# EAGLE schematic joint_1 (EAGLE 9.6.2)
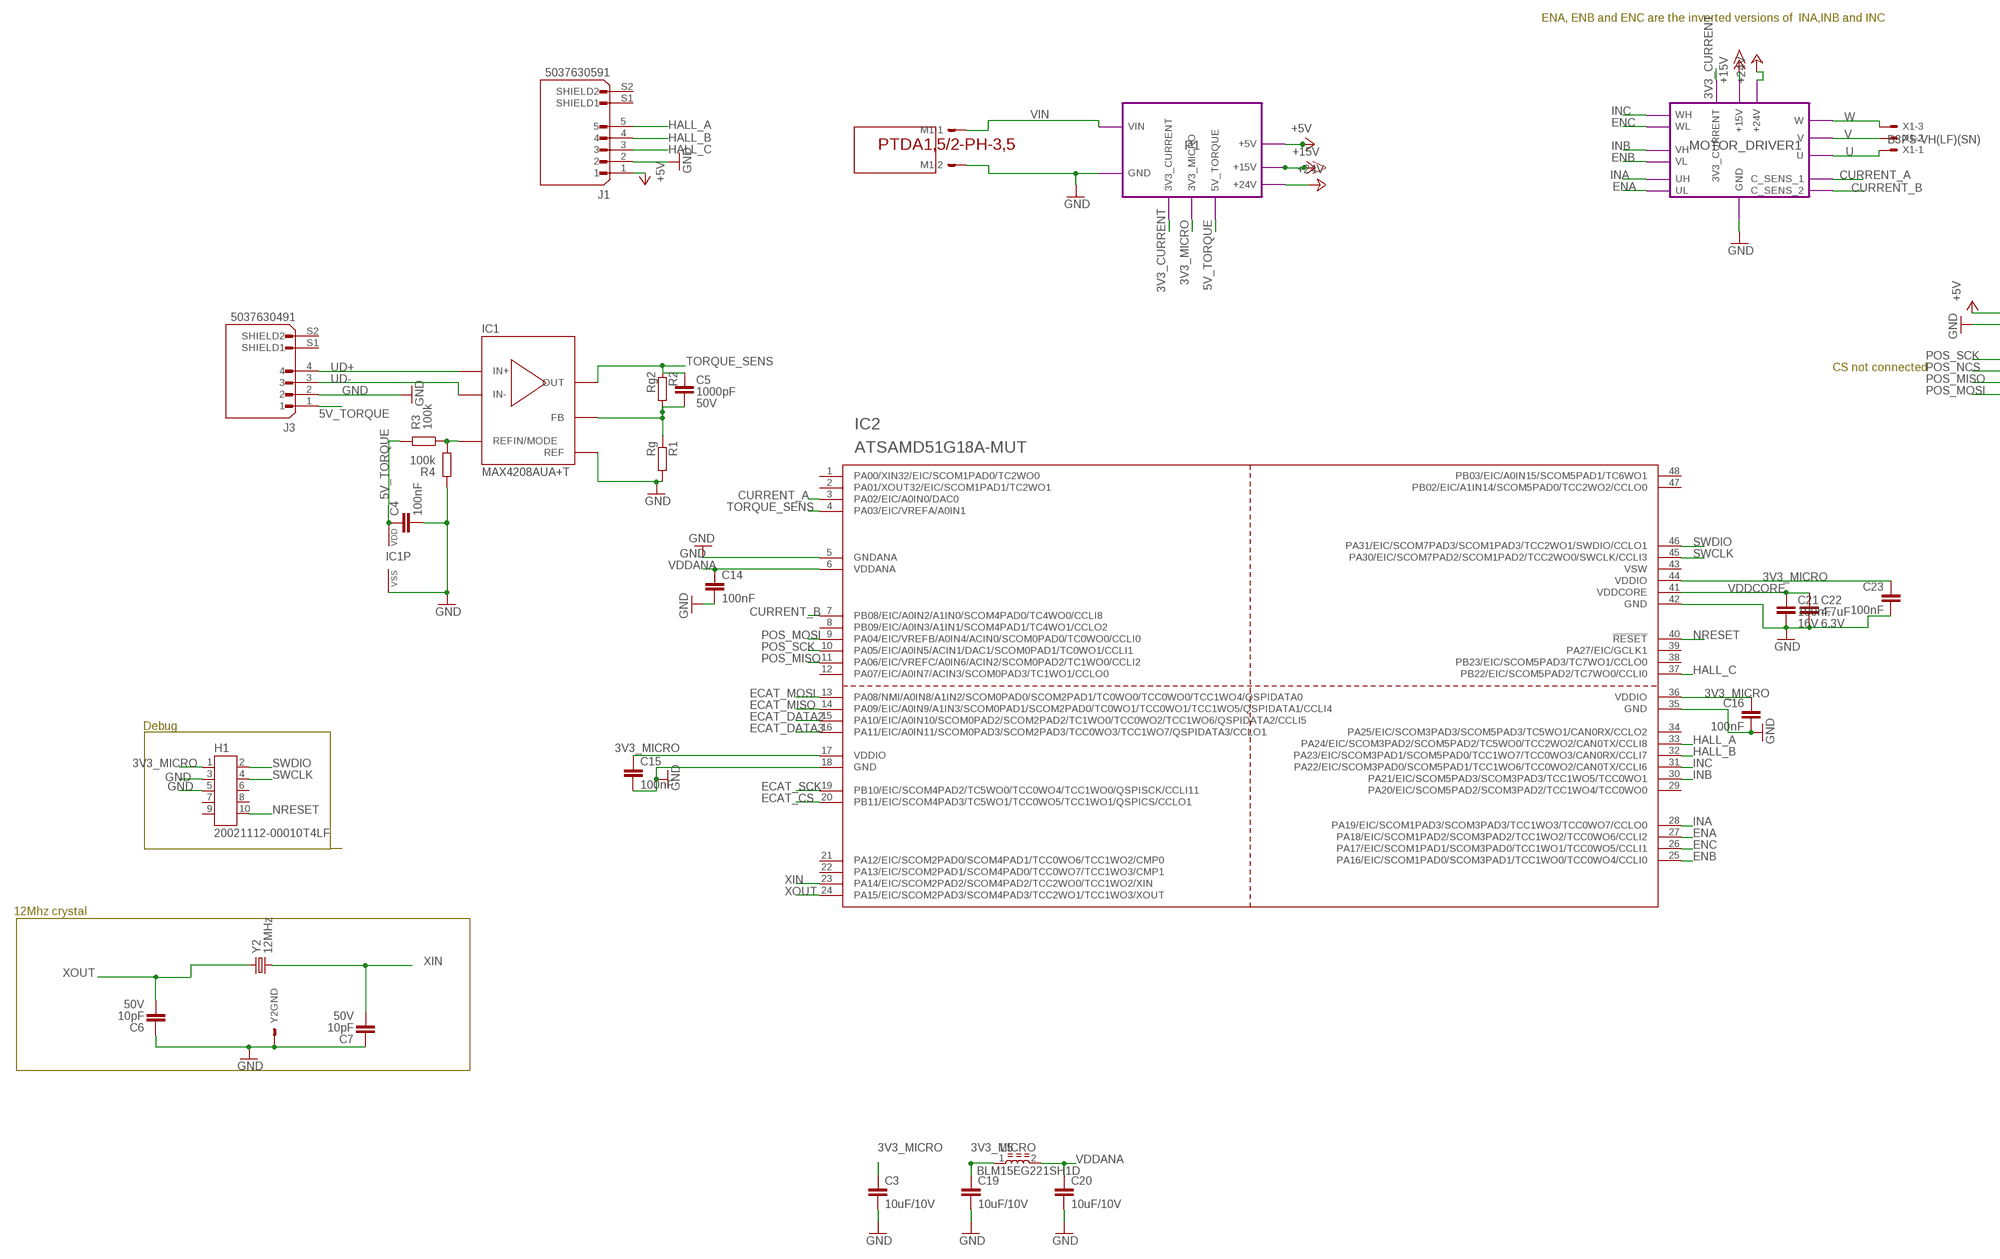
[diagram p0: schematic, sheet 1, part 1 of 2]
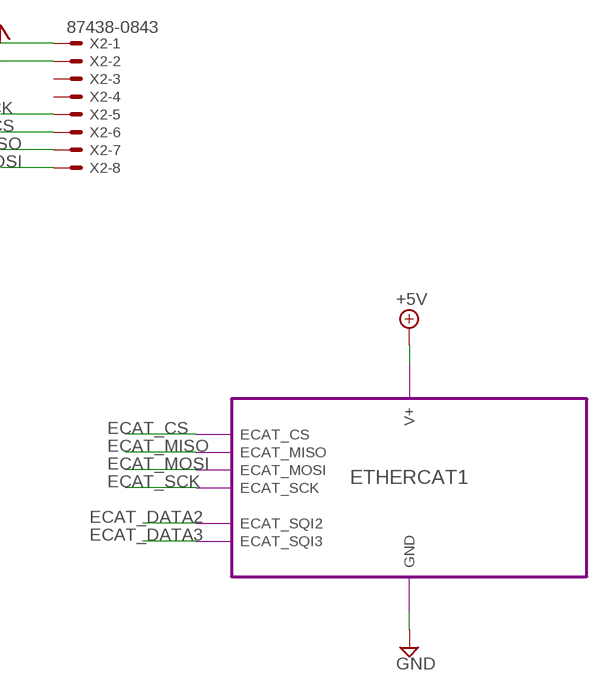
[diagram p1: schematic, sheet 1, part 2 of 2]

## Parts
C3  10uF/10V  C-EUC0603  [C0603]
C4  100nF  C-EUC0402  [C0402]
C5  GCM1555C1H102FA16  [C0402]
C6  GCM1555C1H100JA16  [C0402]
C7  GCM1555C1H100JA16  [C0402]
C14  100nF  C-EUC0402  [C0402]
C15  100nF  C-EUC0402  [C0402]
C16  100nF  C-EUC0402  [C0402]
C19  10uF/10V  C-EUC0603  [C0603]
C20  10uF/10V  C-EUC0603  [C0603]
C21  GCM155R71C104JA55  [C0402]
C22  GRM155C80J475MEAAD  [C0402]
C23  100nF  C-EUC0402  [C0402]
H1  20021112-00010T4LF  [20021112-00010]
IC1  MAX4208AUA+T  [USOP8]
IC2  ATSAMD51G18A-MUT  [QFN48]
J1  5037630591  [MOLEX_5037630591]
J3  5037630491  [MOLEX_5037630491]
L5  BLM15EG221SH1D  [BEAD0402]
M1  PST1,3/2-3,5  [1945096]
R1  Rg  R-EU_R0402  [R0402]
R2  Rg2  R-EU_R0402  [R0402]
R3  RT0402FRE07100KL  [R0402]
R4  RT0402FRE07100KL  [R0402]
U$1  PTDA1,5/2-PH-3,5  [1725107]
X1  B3PS-VH(LF)(SN)  [B3PS-VH(LF)(SN)]
X2  87438-0843  [87438-08]
Y2  ECS-120-10-36B-CKY-TR  [ECX-2236]

## Module instances
MOTOR_DRIVER1 = MOTOR_DRIVER
P1 = POWER
ETHERCAT1 = ETHERCAT

## Nets
3V3_CURRENT: port P1.3V3_CURRENT MOTOR_DRIVER1.3V3_CURRENT
3V3_MICRO: C3.1 C15.1 C16.1 C19.1 C23.1 H1.1 IC2.17(VDDIO) IC2.36(VDDIO) IC2.44(VDDIO) L5.1 ; port P1.3V3_MICRO
5V_TORQUE: C4.1 IC1.8(VDD) J3.1 R3.2 ; port P1.5V_TORQUE
+5V: J1.1 X2.1 ; port P1.+5V ETHERCAT1.V+
+15V: port P1.+15V MOTOR_DRIVER1.+15V
+24V: port P1.+24V MOTOR_DRIVER1.+24V
CURRENT_A: IC2.3(PA02/EIC/A0IN0/DAC0) ; port MOTOR_DRIVER1.C_SENS_1
CURRENT_B: IC2.7(PB08/EIC/A0IN2/A1IN0/SCOM4PAD0/TC4WO0/CCLI8) ; port MOTOR_DRIVER1.C_SENS_2
ECAT_CS: IC2.20(PB11/EIC/SCOM4PAD3/TC5WO1/TCC0WO5/TCC1WO1/QSPICS/CCLO1) ; port ETHERCAT1.ECAT_CS
ECAT_DATA2: IC2.15(PA10/EIC/A0IN10/SCOM0PAD2/SCOM2PAD2/TC1WO0/TCC0WO2/TCC1WO6/QSPIDATA2/CCLI5) ; port ETHERCAT1.ECAT_SQI2
ECAT_DATA3: IC2.16(PA11/EIC/A0IN11/SCOM0PAD3/SCOM2PAD3/TCC0WO3/TCC1WO7/QSPIDATA3/CCLO1) ; port ETHERCAT1.ECAT_SQI3
ECAT_MISO: IC2.14(PA09/EIC/A0IN9/A1IN3/SCOM0PAD1/SCOM2PAD0/TC0WO1/TCC0WO1/TCC1WO5/QSPIDATA1/CCLI4) ; port ETHERCAT1.ECAT_MISO
ECAT_MOSI: IC2.13(PA08/NMI/A0IN8/A1IN2/SCOM0PAD0/SCOM2PAD1/TC0WO0/TCC0WO0/TCC1WO4/QSPIDATA0) ; port ETHERCAT1.ECAT_MOSI
ECAT_SCK: IC2.19(PB10/EIC/SCOM4PAD2/TC5WO0/TCC0WO4/TCC1WO0/QSPISCK/CCLI11) ; port ETHERCAT1.ECAT_SCK
ENA: IC2.27(PA18/EIC/SCOM1PAD2/SCOM3PAD2/TCC1WO2/TCC0WO6/CCLI2) ; port MOTOR_DRIVER1.UL
ENB: IC2.25(PA16/EIC/SCOM1PAD0/SCOM3PAD1/TCC1WO0/TCC0WO4/CCLI0) ; port MOTOR_DRIVER1.VL
ENC: IC2.26(PA17/EIC/SCOM1PAD1/SCOM3PAD0/TCC1WO1/TCC0WO5/CCLI1) ; port MOTOR_DRIVER1.WL
GND: C3.2 C4.2 C6.1 C7.1 C14.2 C15.2 C16.2 C19.2 C20.2 C21.2 C22.2 C23.2 H1.3 H1.5 IC1.4(VSS) IC1.5(REF) IC2.5(GNDANA) IC2.18(GND) IC2.35(GND) IC2.42(GND) J1.2 J3.2 M1.2 R1.2 R4.2 X2.2 Y2.2(S) Y2.4(S) ; port P1.GND MOTOR_DRIVER1.GND ETHERCAT1.GND
HALL_A: IC2.33(PA24/EIC/SCOM3PAD2/SCOM5PAD2/TC5WO0/TCC2WO2/CAN0TX/CCLI8) J1.5
HALL_B: IC2.32(PA23/EIC/SCOM3PAD1/SCOM5PAD0/TCC1WO7/TCC0WO3/CAN0RX/CCLI7) J1.4
HALL_C: IC2.37(PB22/EIC/SCOM5PAD2/TC7WO0/CCLI0) J1.3
INA: IC2.28(PA19/EIC/SCOM1PAD3/SCOM3PAD3/TCC1WO3/TCC0WO7/CCLO0) ; port MOTOR_DRIVER1.UH
INB: IC2.30(PA21/EIC/SCOM5PAD3/SCOM3PAD3/TCC1WO5/TCC0WO1) ; port MOTOR_DRIVER1.VH
INC: IC2.31(PA22/EIC/SCOM3PAD0/SCOM5PAD1/TCC1WO6/TCC0WO2/CAN0TX/CCLI6) ; port MOTOR_DRIVER1.WH
N$1: C5.2 IC1.6(FB) R1.1 R2.2
N$2: IC1.1(REFIN/MODE) R3.1 R4.1
NRESET: H1.10 IC2.40(!RESET)
POS_MISO: IC2.11(PA06/EIC/VREFC/A0IN6/ACIN2/SCOM0PAD2/TC1WO0/CCLI2) X2.7
POS_MOSI: IC2.9(PA04/EIC/VREFB/A0IN4/ACIN0/SCOM0PAD0/TC0WO0/CCLI0) X2.8
POS_NCS: X2.6
POS_SCK: IC2.10(PA05/EIC/A0IN5/ACIN1/DAC1/SCOM0PAD1/TC0WO1/CCLI1) X2.5
SWCLK: H1.4 IC2.45(PA30/EIC/SCOM7PAD2/SCOM1PAD2/TCC2WO0/SWCLK/CCLI3)
SWDIO: H1.2 IC2.46(PA31/EIC/SCOM7PAD3/SCOM1PAD3/TCC2WO1/SWDIO/CCLO1)
TORQUE_SENS: C5.1 IC1.7(OUT) IC2.4(PA03/EIC/VREFA/A0IN1) R2.1
U: X1.3 ; port MOTOR_DRIVER1.U
UD+: IC1.3(IN+) J3.4
UD-: IC1.2(IN-) J3.3
V: X1.2 ; port MOTOR_DRIVER1.V
VDDANA: C14.1 C20.1 IC2.6(VDDANA) L5.2
VDDCORE: C21.1 C22.1 IC2.41(VDDCORE)
VIN: M1.1 ; port P1.VIN
W: X1.1 ; port MOTOR_DRIVER1.W
XIN: C7.2 IC2.23(PA14/EIC/SCOM2PAD2/SCOM4PAD2/TCC2WO0/TCC1WO2/XIN) Y2.1
XOUT: C6.2 IC2.24(PA15/EIC/SCOM2PAD3/SCOM4PAD3/TCC2WO1/TCC1WO3/XOUT) Y2.3
Unconnected: H1.6 H1.7 H1.8 H1.9 IC2.1(PA00/XIN32/EIC/SCOM1PAD0/TC2WO0) IC2.2(PA01/XOUT32/EIC/SCOM1PAD1/TC2WO1) IC2.8(PB09/EIC/A0IN3/A1IN1/SCOM4PAD1/TC4WO1/CCLO2) IC2.12(PA07/EIC/A0IN7/ACIN3/SCOM0PAD3/TC1WO1/CCLO0) IC2.21(PA12/EIC/SCOM2PAD0/SCOM4PAD1/TCC0WO6/TCC1WO2/CMP0) IC2.22(PA13/EIC/SCOM2PAD1/SCOM4PAD0/TCC0WO7/TCC1WO3/CMP1) IC2.29(PA20/EIC/SCOM5PAD2/SCOM3PAD2/TCC1WO4/TCC0WO0) IC2.34(PA25/EIC/SCOM3PAD3/SCOM5PAD3/TC5WO1/CAN0RX/CCLO2) IC2.38(PB23/EIC/SCOM5PAD3/TC7WO1/CCLO0) IC2.39(PA27/EIC/GCLK1) IC2.43(VSW) IC2.47(PB02/EIC/A1IN14/SCOM5PAD0/TCC2WO2/CCLO0) IC2.48(PB03/EIC/A0IN15/SCOM5PAD1/TC6WO1) J1.S1(SHIELD1) J1.S2(SHIELD2) J3.S1(SHIELD1) J3.S2(SHIELD2) X2.3 X2.4

## Notes on the sheet
- ENA, ENB and ENC are the inverted versions of  INA,INB and INC
- CS not connected
- Debug
- 12Mhz crystal

## Library data of the parts
C3 C4 C14-C16 C19 C20 C23 = rcl:C-EU: CAPACITOR, European symbol; SPICEPREFIX: C
C5 = msrm:GCM?5C*: Multilayer Ceramic Capacitors; CAPACITANCE: 1000pF; DIGIKEY: 490-16461-1-ND; TOLERANCE: ±1%; VOLTAGE: 50V
C6 C7 = msrm:GCM?5C*: Multilayer Ceramic Capacitors; CAPACITANCE: 10pF; DIGIKEY: 490-10668-1-ND; TOLERANCE: ±5%; VOLTAGE: 50V
C21 = msrm:GCM?R7*: Multilayer Ceramic Capacitors; CAPACITANCE: 100nF; DIGIKEY: 490-16433-1-ND; TOLERANCE: ±5%; VOLTAGE: 16V
C22 = msrm:GRM?C8*: CAP CER 10UF 6.3V X6S 0402 package: C0402 : 10µF ___ Source: Digikey <https://www.digikey.de/products/en?keywords=490-13233-1-ND> ; Datasheet <https://search.murata.co.jp/Ceramy/image/img/A01X/G101/ENG/GRM155C80J106ME11-01.pdf> 2.2µF ___ Source: Digikey <https://www.digikey.de/products/en?keywords=490-10012-1-ND> ; Datasheet <https://search.murata.co.jp/Ceramy/image/img/A01X/G101/ENG/GRM155C80J225KE95-01.pdf> 4.7µF ___ Source: Digikey <https://www.digikey.de/products/en?keywords=490-14458-1-ND> ; Datasheet <https://search.murata.co.jp/Ceramy/image/img/A01X/G101/ENG/GRM155C80J475MEAA-01.pdf>; CAPACITANCE: 4.7uF; DIGIKEY: 490-14458-1-ND; TOLERANCE: ±20%; VOLTAGE: 6.3V
H1 = msrm:20021?10*LF: Connector Header Surface Mount 10 position 0.050" (1.27mm) Variant: 111-000 609-5923-ND ___ Source: Digikey <https://www.digikey.de/products/de?keywords=609-5923-ND> ; Datasheet <https://cdn.amphenol-icc.com/media/wysiwyg/files/drawing/20021111.pdf> 609-3712-ND ___ Source: Digikey <https://www.digikey.de/products/de?keywords=609-3712-ND> ; Datasheet <https://media.digikey.com/pdf/Data%20Sheets/FCI%20PDFs/Minitek%20127_Catalog.pdf> Variant: 112-000 609-5926-ND ___ Source: Digikey <https://www.digikey.de/products/de?keywords=609-5926-ND> ; Datasheet <https://cdn.amphenol-icc.com/media/wysiwyg/files/drawing/20021112.pdf> Variant: 121-000 609-3695-1-ND ___ Source: Digikey <https://www.digikey.de/products/de?keywords=609-3695-1-ND> ; Datasheet <https://cdn.amphenol-icc.com/media/wysiwyg/files/drawing/20021121.pdf> 609-6529-ND ___ Source: Digikey <https://www.digikey.de/products/de?keywords=609-6529-ND> ; Datasheet <https://cdn.amphenol-icc.com/media/wysiwyg/files/drawing/20021121.pdf> 609-3729-ND ___ Source: Digikey <https://www.digikey.de/products/de?keywords=609-3729-ND> ; Datasheet <https://cdn.amphenol-icc.com/media/wysiwyg/files/drawing/20021121.pdf> Variant: 311-000 609-3754-ND ___ Source: Digikey <https://www.digikey.de/products/de?keywords=609-3754-ND> ; Datasheet <https://cdn.amphenol-icc.com/media/wysiwyg/files/drawing/20021311.pdf>; DIGIKEY: 609-5926-ND; PINS: 10
IC1 = msrm:MAX42*: Instrument Amp Single R-R O/P 2.75/5.5V package: USOP8 : MAX4289 ___ Source: Digikey <https://www.digikey.de/product-detail/en/maxim-integrated/MAX4208AUA-T/MAX4208AUA-TCT-ND/9760057> ; Datasheet <http://datasheets.maximintegrated.com/en/ds/MAX4208-MAX4209.pdf> MAX4209 ___ Source: Digikey <https://www.digikey.de/product-detail/en/maxim-integrated/MAX4209HAUA/MAX4209HAUA-ND/1780104> ; Datasheet <http://datasheets.maximintegrated.com/en/ds/MAX4208-MAX4209.pdf>; DESCRIPTION: Instrument Amp Single R-R O/P 2.75/5.5V; DIGIKEY: MAX4208AUA+-ND; HEIGHT: 1.1mm; INPUT_RESISTANCE: 2G; MANUFACTURER_NAME: Maxim Integrated; MANUFACTURER_PART_NUMBER: MAX4208AUA+; MOUSER_PART_NUMBER: 700-MAX4208AUA; MOUSER_PRICE-STOCK: https://www.mouser.com/Search/Refine.aspx?Keyword=700-MAX4208AUA; RS_PART_NUMBER: 7328406P; RS_PRICE-STOCK: http://uk.rs-online.com/web/p/products/7328406P; SPICEPREFIX: X; SUPPLY_CURRENT: Buffer OFF: 0.75 - 1.3 mA Buffer ON: 1.4 - 2.3 mA; SUPPLY_VOLTAGE: Single: 2.85 - 5.5 Dual: ±1.425 - ±2.75; VOLTAGE_GAIN: 1 - (1 + R2/R1)
IC2 = msrm:ATSAMD51G: Atmel C21 32bit ARM Cortex-M0 microcontroller. Pins 64 GPIO 52 TC 5 TCC 3 DMA 12 USB No CAN 2 CCL 4 SERCOM 6 I2S 0 DIVAS Yes ADCch 20 ADC 2 ADCSDch 3 AC 4 DAC 1 TSENS 1 RTC 1 EIC 16 PTC 32 FREQM Yes MAX_F 48MHz EVENTS 12 WDT Yes SWDI Yes package: QFN48 : D51G18A-MUTCT ___ Source: Digikey <https://www.digikey.de/products/de?keywords=ATSAMD51G18A-MUTCT-ND> ; Datasheet <http://www.microchip.com/mymicrochip/filehandler.aspx?ddocname=en599585> D51G19A-MU ______ Source: Digikey <https://www.digikey.de/products/de?keywords=ATSAMD51G19A-MU-ND> ; Datasheet <http://www.microchip.com/mymicrochip/filehandler.aspx?ddocname=en599585>; DIGIKEY: ATSAMD51G18A-MUTCT-ND; FLASH: 256KB; SRAM: 128KB
J1 = 5037630591:5037630591: Check availability <https://pricing.snapeda.com/parts/503763-0591/Molex/view-part?ref=eda>; AVAILABILITY: In Stock; DESCRIPTION: Connector Header Surface Mount, Right Angle 5 position 0.039 (1.00mm); MF: Molex; MP: 503763-0591; PACKAGE: None; PRICE: None; PURCHASE-URL: https://pricing.snapeda.com/search/part/503763-0591/?ref=eda
J3 = 5037630491:5037630491: Check availability <https://pricing.snapeda.com/parts/5037630491/Molex/view-part?ref=eda>; AVAILABILITY: In Stock; DESCRIPTION: Connector Header Surface Mount, Right Angle 4 position 0.039 (1.00mm); MF: Molex; MP: 5037630491; PACKAGE: None; PRICE: None; PURCHASE-URL: https://pricing.snapeda.com/search/part/5037630491/?ref=eda
L5 = msrm:BLM?EG*1D: Murata's SMD Ferrite Bead BLM18EG Series Source: Part Numbering <https://www.murata.com/en-us/products/productdata/8796733767710/S0580E.pdf>; DC_RES: 280mOhm; DIGIKEY: 490-17345-1-ND; IMPEDANCE-FREQUENCY: 220 Ohms @ 100MHz
M1 = msrm:PST*/2-?: 2 Position Terminal Block Header, Male Pins, Unshrouded 0.138" (3.50mm) Vertical Through Hole 277-1749-ND ___ Source: Digikey <https://www.digikey.de/products/en?keywords=277-1749-ND> ; Datasheet <https://media.digikey.com/pdf/Data%20Sheets/Phoenix%20Contact%20PDFs/Combicon%20Compact%20Series.pdf>; DIGIKEY: 277-1749-ND; PITCH: 3,5
R1 R2 = rcl:R-EU_: RESISTOR, European symbol; SPICEPREFIX: R
R3 R4 = msrm:RT?FRE07*L: SMD RESISTOR; DIGIKEY: YAG2307CT-ND; RVALUE: 100k; SPICEPREFIX: R
U$1 = msrm:PTDA*/2-PH: 2 Position Terminal Block Plug for Unshrouded Header 0.138" (3.50mm) 45° Free Hanging (In-Line) 277-17182-ND ___ Source: Digikey <https://www.digikey.de/products/en?keywords=277-17182-ND> ; Datasheet <https://media.digikey.com/PDF/Data%20Sheets/Phoenix%20Contact%20PDFs/1725107.pdf>; DIGIKEY: 277-17182-ND
X1 = msrm:B3PS-VH(LF)(SN): Connector Header Through Hole, Right Angle 3 position 0.156" (3.96mm) 455-1649 ___ Source: Digikey <https://www.digikey.de/product-detail/en/jst-sales-america-inc/B3PS-VH-LF-SN/455-1649-ND/926556> ; Datasheet <http://www.jst-mfg.com/product/pdf/eng/eVH.pdf>; DIGIKEY: 455-1649-ND
X2 = msrm:8743?-08*3: Wire-to-Board 1.50mm (.059") Pitch Header - SMT, Shrouded Source: http://www.molex.com/product/micro/87437.html; DIGIKEY: WM7652CT-ND
Y2 = msrm:ECS-*?-TR: SMD CRYSTAL Various frequencies, with GND pins Part Numbering <http://www.ecsxtal.com/store/pdf/partnumber4.pdf> package: ECS-33B : XC2845 ___ Source: Digikey <https://www.digikey.de/products/en?keywords=%20XC2845CT-ND> ; Datasheet <https://ecsxtal.com/store/pdf/ECS-33B.pdf> XC2439 ___ Source: Digikey <https://www.digikey.de/products/en?keywords=XC2439CT-ND> ; Datasheet <https://ecsxtal.com/store/pdf/ECS-33B.pdf> XC2458 ___ Source: Digikey <https://www.digikey.de/products/en?keywords=XC2458CT-ND> ; Datasheet <https://ecsxtal.com/store/pdf/ECS-33B.pdf> XC2479 ___ Source: Digikey <https://www.digikey.de/products/en?keywords=XC2479CT-ND> ; Datasheet <https://ecsxtal.com/store/pdf/ECS-33B.pdf> XC2547 ___ Source: Digikey <https://www.digikey.de/products/en?keywords=XC2547CT-ND> ; Datasheet <https://ecsxtal.com/store/pdf/ECS-33B.pdf> package: ECX2236 : XC3046 ___ Source: Digikey <https://www.digikey.de/products/en?keywords=XC3046CT-ND> ; Datasheet <https://ecsxtal.com/store/pdf/ECX-2236B.pdf> XC3048 ___ Source: Digikey <https://www.digikey.de/products/en?keywords=XC3048CT-ND> ; Datasheet <https://ecsxtal.com/store/pdf/ECX-2236B.pdf> XC3051 ___ Source: Digikey <https://www.digikey.de/products/en?keywords=XC3051CT-ND> ; Datasheet <https://ecsxtal.com/store/pdf/ECX-2236B.pdf> XC3093 ___ Source: Digikey <https://www.digikey.de/products/en?keywords=XC3093CT-ND> ; Datasheet <https://ecsxtal.com/store/pdf/ECX-2236B.pdf> XC3053 ___ Source: Digikey <https://www.digikey.de/products/en?keywords=XC3053CT-ND> ; Datasheet <https://ecsxtal.com/store/pdf/ECX-2236B.pdf> XC3052 ___ Source: Digikey <https://www.digikey.de/products/en?keywords=XC3052CT-ND> ; Datasheet <https://ecsxtal.com/store/pdf/ECX-2236B.pdf> XC3054 ___ Source: Digikey <https://www.digikey.de/products/en?keywords=XC3054CT-ND> ; Datasheet <https://ecsxtal.com/store/pdf/ECX-2236B.pdf> XC3057 ___ Source: Digikey <https://www.digikey.de/products/en?keywords=XC3057CT-ND> ; Datasheet <https://ecsxtal.com/store/pdf/ECX-2236B.pdf> XC3058 ___ Source: Digikey <https://www.digikey.de/products/en?keywords=XC3058CT-ND> ; Datasheet <https://ecsxtal.com/store/pdf/ECX-2236B.pdf> XC3060 ___ Source: Digikey <https://www.digikey.de/products/en?keywords=XC3060CT-ND> ; Datasheet <https://ecsxtal.com/store/pdf/ECX-2236B.pdf> XC3059 ___ Source: Digikey <https://www.digikey.de/products/en?keywords=XC3059CT-ND> ; Datasheet <https://ecsxtal.com/store/pdf/ECX-2236B.pdf>; DIGIKEY: XC3046CT-ND; ESR: 130 Ohm; F: 12MHz; F_TOLERANCE: ±10ppm; L_CAPACITANCE: 10pF

## Module MOTOR_DRIVER
Ports: +24V(pwr) GND(pwr) W(out) V(out) U(out) C_SENS_1(out) C_SENS_2(out) WH(in) WL(in) VH(in) VL(in) UH(in) UL(in) +15V(pwr) 3V3_CURRENT(pwr)
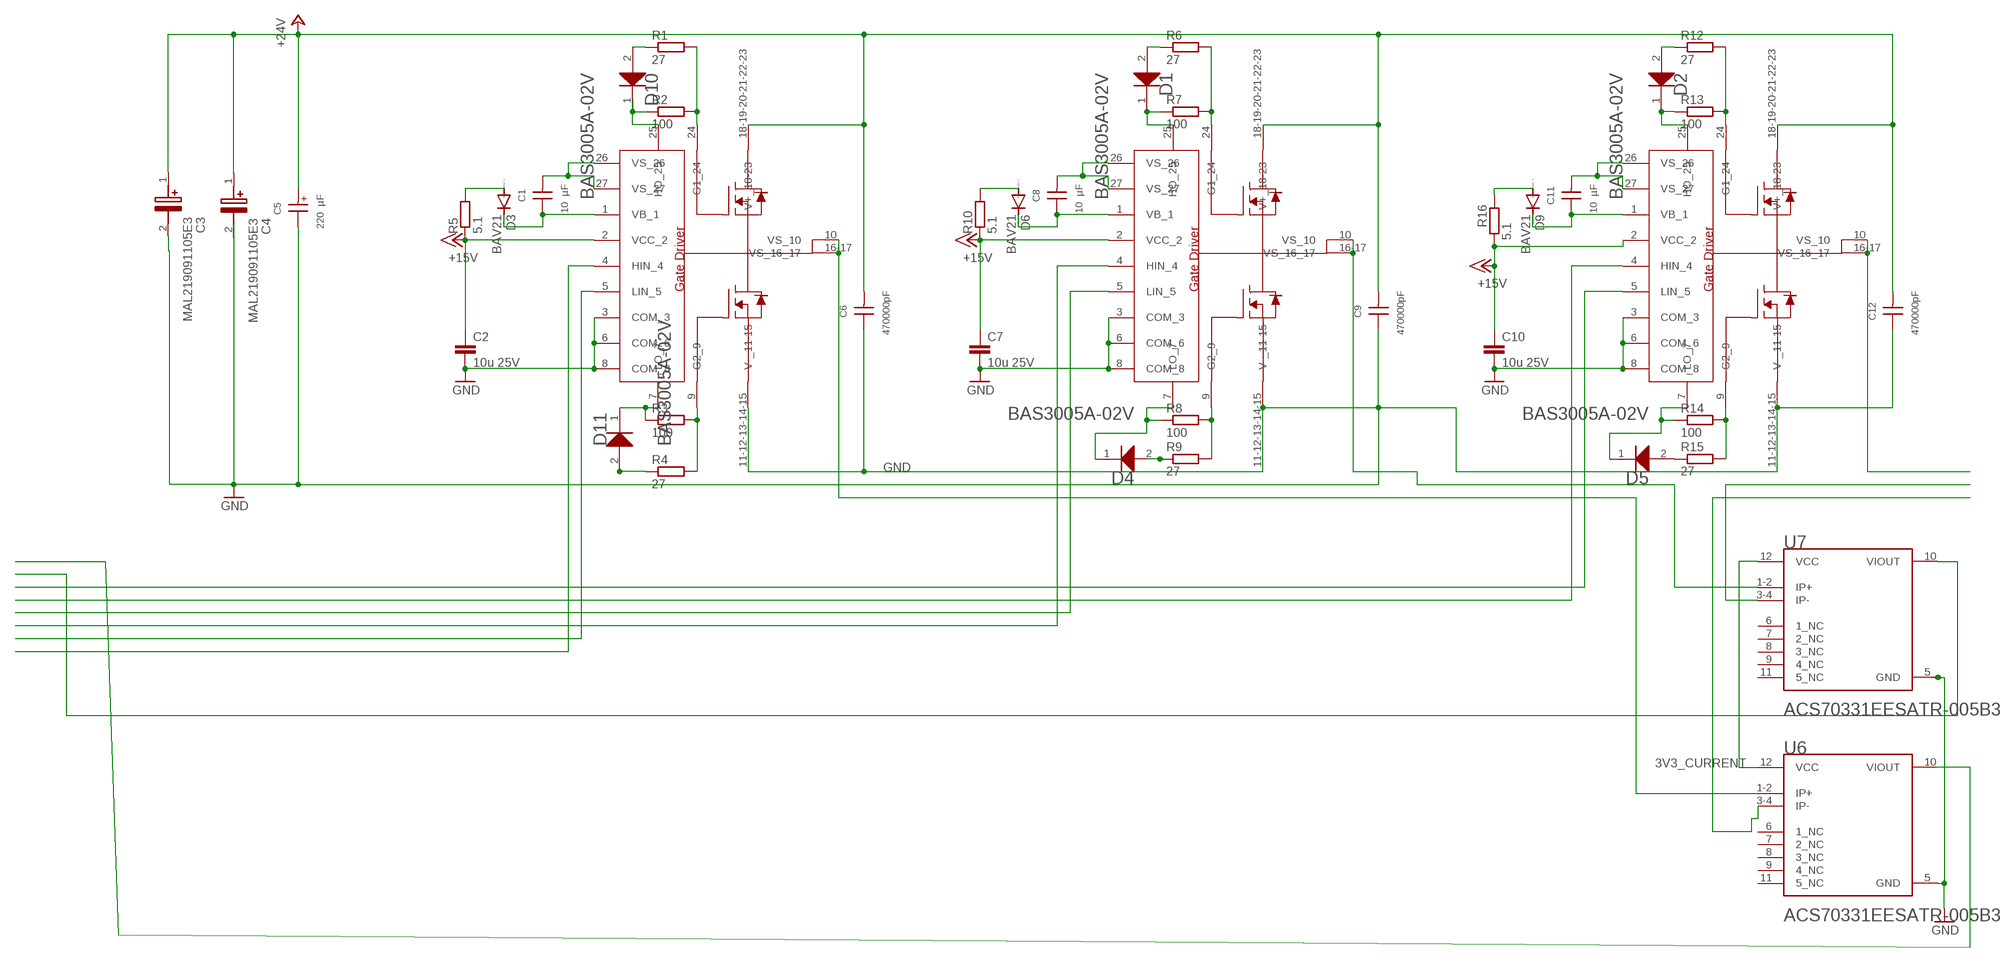
[diagram p2: schematic, module MOTOR_DRIVER, sheet 1]

### Parts
C1  10 µF  WCAP-CSGP_1206_H1.6_885012208069_25V(DC)  [WCAP-CSGP_1206_H1.6]
C2  10u 25V  C-EUC0402  [C0402]
C3  MAL219091105E3  [CAPPRD750W80D1650H2700]
C4  MAL219091105E3  [CAPPRD750W80D1650H2700]
C5  220 µF  WCAP-ATG8_6.3X11_860010473011  [WCAP-ATG8_6.3X11(DXL)]
C6  470000pF  WCAP-CSMH_1812_H2.0_885342211003  [WCAP-CSMH_1812_H2.0]
C7  10u 25V  C-EUC0402  [C0402]
C8  10 µF  WCAP-CSGP_1206_H1.6_885012208069_25V(DC)  [WCAP-CSGP_1206_H1.6]
C9  470000pF  WCAP-CSMH_1812_H2.0_885342211003  [WCAP-CSMH_1812_H2.0]
C10  10u 25V  C-EUC0402  [C0402]
C11  10 µF  WCAP-CSGP_1206_H1.6_885012208069_25V(DC)  [WCAP-CSGP_1206_H1.6]
C12  470000pF  WCAP-CSMH_1812_H2.0_885342211003  [WCAP-CSMH_1812_H2.0]
D1  INFINEON_BAS3005A-02VINFINEON_BAS3005A-02V_0_0  [INFINEON_BAS3005A-02V_0]
D2  INFINEON_BAS3005A-02VINFINEON_BAS3005A-02V_0_0  [INFINEON_BAS3005A-02V_0]
D3  BAV21  [DO35-10]
D4  INFINEON_BAS3005A-02VINFINEON_BAS3005A-02V_0_0  [INFINEON_BAS3005A-02V_0]
D5  INFINEON_BAS3005A-02VINFINEON_BAS3005A-02V_0_0  [INFINEON_BAS3005A-02V_0]
D6  BAV21  [DO35-10]
D9  BAV21  [DO35-10]
D10  INFINEON_BAS3005A-02VINFINEON_BAS3005A-02V_0_0  [INFINEON_BAS3005A-02V_0]
D11  INFINEON_BAS3005A-02VINFINEON_BAS3005A-02V_0_0  [INFINEON_BAS3005A-02V_0]
R1  27  R-EU_R0402  [R0402]
R2  100  R-EU_R0402  [R0402]
R3  100  R-EU_R0402  [R0402]
R4  27  R-EU_R0402  [R0402]
R5  5.1  R-EU_R0402  [R0402]
R6  27  R-EU_R0402  [R0402]
R7  100  R-EU_R0402  [R0402]
R8  100  R-EU_R0402  [R0402]
R9  27  R-EU_R0402  [R0402]
R10  5.1  R-EU_R0402  [R0402]
R12  27  R-EU_R0402  [R0402]
R13  100  R-EU_R0402  [R0402]
R14  100  R-EU_R0402  [R0402]
R15  27  R-EU_R0402  [R0402]
R16  5.1  R-EU_R0402  [R0402]
U1  IRSM005-800MHINFINEON_IRSM005-800MH_0_0  [INFINEON_IRSM005-800MH_0]
U2  IRSM005-800MHINFINEON_IRSM005-800MH_0_0  [INFINEON_IRSM005-800MH_0]
U3  IRSM005-800MHINFINEON_IRSM005-800MH_0_0  [INFINEON_IRSM005-800MH_0]
U6  ALLEGRO_MICROSYSTEMS_LLC_ACS70331EESATR-005B3ALLEGRO_MICROSYSTEMS_LLC_ACS70331EESATR-005B3_0_0  [ALLEGRO_MICROSYSTEMS_LLC_ACS70331EESATR-005B3_0]
U7  ALLEGRO_MICROSYSTEMS_LLC_ACS70331EESATR-005B3ALLEGRO_MICROSYSTEMS_LLC_ACS70331EESATR-005B3_0_0  [ALLEGRO_MICROSYSTEMS_LLC_ACS70331EESATR-005B3_0]

### Nets
3V3_CURRENT [pwr]: U6.12(VCC) U7.12(VCC)
+15V [pwr]: C2.1 C7.1 C10.1 R5.1 R10.1 R16.1 U1.2(VCC_2) U2.2(VCC_2) U3.2(VCC_2)
+24V [pwr]: C3.1(+) C4.1(+) C5.1(+) C6.2 C9.2 C12.2 U1.18-19-20-21-22-23(V+_18-23) U2.18-19-20-21-22-23(V+_18-23) U3.18-19-20-21-22-23(V+_18-23)
C_SENS_1 [analog]: U7.10(VIOUT)
C_SENS_2 [analog]: U6.10(VIOUT)
GND [pwr]: C2.2 C3.2(-) C4.2(-) C5.2(-) C6.1 C7.2 C9.1 C10.2 C12.1 U1.3(COM_3) U1.6(COM_6) U1.8(COM_8) U1.11-12-13-14-15(V-_11-15) U2.3(COM_3) U2.6(COM_6) U2.8(COM_8) U2.11-12-13-14-15(V-_11-15) U3.3(COM_3) U3.6(COM_6) U3.8(COM_8) U3.11-12-13-14-15(V-_11-15) U6.5(GND) U7.5(GND)
N$1 [analog]: R1.2 R2.2 U1.24(G1_24)
N$2 [analog]: D10.2(A) R1.1
N$3 [analog]: D10.1(K) R2.1 U1.25(HO_25)
N$4 [analog]: R6.2 R7.2 U2.24(G1_24)
N$5 [analog]: R3.2 R4.2 U1.9(G2_9)
N$6 [analog]: D11.2(A) R4.1
N$7 [analog]: D11.1(K) R3.1 U1.7(LO_7)
N$8 [analog]: C1.2 U1.26(VS_26) U1.27(VS_27)
N$9 [analog]: C1.1 D3.C U1.1(VB_1)
N$10 [analog]: D3.A R5.2
N$12 [analog]: D1.2(A) R6.1
N$13 [analog]: D1.1(K) R7.1 U2.25(HO_25)
N$14 [analog]: R8.2 R9.2 U2.9(G2_9)
N$15 [analog]: D4.2(A) R9.1
N$16 [analog]: D4.1(K) R8.1 U2.7(LO_7)
N$17 [analog]: C8.2 U2.26(VS_26) U2.27(VS_27)
N$18 [analog]: C8.1 D6.C U2.1(VB_1)
N$19 [analog]: D6.A R10.2
N$21 [analog]: R12.2 R13.2 U3.24(G1_24)
N$22 [analog]: D2.2(A) R12.1
N$23 [analog]: D2.1(K) R13.1 U3.25(HO_25)
N$24: R14.2 R15.2 U3.9(G2_9)
N$25 [analog]: D5.2(A) R15.1
N$26 [analog]: D5.1(K) R14.1 U3.7(LO_7)
N$27 [analog]: C11.2 U3.26(VS_26) U3.27(VS_27)
N$28 [analog]: C11.1 D9.C U3.1(VB_1)
N$29 [analog]: D9.A R16.2
U [analog]: U6.3-4(IP-)
U1 [analog]: U1.10(VS_10) U1.16-17(VS_16_17) U6.1-2(IP+)
UH [power]: U1.4(HIN_4)
UL [power]: U1.5(LIN_5)
V [analog]: U7.3-4(IP-)
V1 [analog]: U2.10(VS_10) U2.16-17(VS_16_17) U7.1-2(IP+)
VH [power]: U2.4(HIN_4)
VL [power]: U2.5(LIN_5)
W [analog]: U3.10(VS_10) U3.16-17(VS_16_17)
WH [power]: U3.4(HIN_4)
WL [power]: U3.5(LIN_5)
Unconnected: U6.6(1_NC) U6.7(2_NC) U6.8(3_NC) U6.9(4_NC) U6.11(5_NC) U7.6(1_NC) U7.7(2_NC) U7.8(3_NC) U7.9(4_NC) U7.11(5_NC)

### Library data of the parts
C1 C8 C11 = Wurth_Capacitors_WCAP-CSGP:WCAP-CSGP_1206_H1.6: WCAP-CSGP MLCCs 1206 General Purpose Characteristics General purpose product series High performance ceramic High electrical precision and stability ceramic especially for NP0 Minimal aging especially for NP0 Mounting style: SMT-Chip Ceramic: NP0 (Class I), X5R (Class II), X7R (Class II) Capacitance range: 1 pF ‒ 100 µF Temperature Coefficient: ±30 ppm/°C; ±0.54 % for NP0 ±15 % for X7R and X5R Voltage range (UR): 6.3 ‒ 100 V(DC) Operating temperature: -55 °C up to + 125 °C for NP0 and X7R -55 °C up to + 85 °C for X5R Termination: Cu/Ni/Sn Recommended soldering: Reflow soldering Applications Temperature compensation (NP0) Coupling Decoupling Bypass Smoothing Filtering Resonant circuit <https://www.we-online.com/catalog/media/o166501v209%20Family_WE-MLCC_1206_dunkelbraun.jpg> Details see: https://www.we-online.com/catalog/en/WCAP-CSGP-1206/ Updated by yingchun,Shan;2020-03-09 2020(C) Würth Elektronik; CERAMIC-TYPE: X7R Class II; DATASHEET-URL: https://www.we-online.com/catalog/datasheet/885012208069.pdf; DF: 0.1; H: 1.6mm; OPERATING-TEMPERATURE: -55 °C up to +125 °C; PART-NUMBER: 885012208069; QMIN: -; RISO: 0.01GOhm; TECHNICAL-REFERENCE: X7R1206106K025DFCT10000; TOL-VALUE: ±10%; VR: 25V(DC)
C2 C7 C10 = rcl:C-EU: CAPACITOR, European symbol; SPICEPREFIX: C
C3 C4 = MAL219091105E3:MAL219091105E3: Aluminum Electrolytic Capacitors - Radial Leaded 1000uF 50V 16 x 25 Source: Datasheet <https://www.vishay.com/docs/28465/190rtl.pdf>; DESCRIPTION: Aluminum Electrolytic Capacitors - Radial Leaded 1000uF 50V 16 x 25; HEIGHT: 27mm; MANUFACTURER_NAME: Vishay; MANUFACTURER_PART_NUMBER: MAL219091105E3; MOUSER_PART_NUMBER: 594-MAL219091105E3; MOUSER_PRICE-STOCK: https://www.mouser.co.uk/ProductDetail/Vishay-BC-Components/MAL219091105E3?qs=W%2FMpXkg%252BdQ4f95s%252BY5cfkQ%3D%3D
C5 = Wurth_Capacitors_WCAP-ATG8:WCAP-ATG8_6.3X11: WCAP-ATG8 Aluminium Electrolytic Capacitors General Purpose +85 °C Characteristics General purpose product series with max. operating temperature of +85 °C Wide range of capacitance value Mounting style: THT Radial Capacitance range: 0.1 µF ‒ 33000 µF Capacitance tolerance: ±20 % Voltage range (UR): 10 ‒ 400 V(DC) Operating temperature: -40 °C up to +85 °C for UR < 400 V(DC) -25 °C up to +85 °C for UR ≥ 400 V(DC) Endurance: 2000 h @ +85 °C Dimensions (DxL) in mm: 5.0 x 11.0 up to 22.0 x 51.0 Recommended soldering: Wave soldering Applications Filtering Smoothing Energy storage Coupling <https://www.we-online.com/catalog/media/o35732v209%20WCAP-ATG8_4C.jpg> Details see: https://www.we-online.com/catalog/en/WCAP-ATG8/ Updated by yingchun,Shan;2020-02-27 2020(C) W��rth Elektronik; DATASHEET-URL: https://www.we-online.com/catalog/datasheet/860010473011.pdf; DF: 14%; DIAMETER: 6.3mm; I-LEAK: 55uA; I-RIPPLE: 310mA; L: 11mm; OPERATING-TEMPERATURE: -40 °C up to +85 °C; PART-NUMBER: 860010473011; PITCH: 2.5mm; TECHNICAL-REFERENCE: ATBD110221M025DSPA4B000; VR: 25V(DC)
C6 C9 C12 = Wurth_Capacitors_WCAP-CSMH:WCAP-CSMH_1812_H2.0: WCAP-CSMH MLCCs Mid and High Voltage Characteristics Product series for mid and high voltage up to 3 kV(DC) Mounting style: SMT-Chip Ceramic: NP0 (Class I), X7R (Class II) Capacitance range: 10 pF ‒ 470 nF Temperature Coefficient: ±30 ppm/°C; ±0.54 % for NP0 ±15 % for X7R Voltage range (UR): 200 V(DC) ‒ 3 kV(DC) Operating temperature: -55 °C up to + 125 °C Sizes: 0603 / 0805 / 1206 / 1210 / 1808 / 1812 Termination: Cu/Ni/Sn Recommended soldering: Reflow soldering Wave soldering only valid for 0603, 0805; thickness < 0.85 mm Applications Ports protection against EFT and surge Blocking High voltage coupling Snubber <https://www.we-online.com/catalog/media/o166505v209%20Family_WE-MLCC_1210_dunkelbraun.jpg> Details see: https://www.we-online.com/catalog/en/WCAP-CSMH/ Updated by yingchun,Shan;2020-03-10 2020(C) Würth Elektronik; CERAMIC-TYPE: X7R Class II; DATASHEET-URL: https://www.we-online.com/catalog/datasheet/885342211003.pdf; DF: 2.5%; H: 2mm; OPERATING-TEMPERATURE: -55 / +125°C; PART-NUMBER: 885342211003; QMIN: -; RISO: 0.213GOhm; TECHNICAL-REFERENCE: X7R1812474K250DFCT10000; TOL-C: +/- 10%; VR: 250V(DC)
D1 D2 D4 D5 D10 D11 = Infineon - BAS3005A-02V:INFINEON_BAS3005A-02V: INF-D_K1A2-2; CIIVA_IDS: 21182063; COMPONENT_LINK_1_DESCRIPTION: Manufacturer URL; COMPONENT_LINK_1_URL: http://www.infineon.com/; COMPONENT_LINK_3_DESCRIPTION: Package Specification; COMPONENT_LINK_3_URL: http://www.infineon.com/dgdl/SC79-Package_Overview.pdf?folderId=db3a30431936bc4b011951fbddb03b15&fileId=db3a30431936bc4b01195226fe583b41; CONFIGURATION: single; CT_MAX: 15Â pF; DATASHEET: http://www.infineon.com/dgdl/bas3005aseries.pdf?folderId=db3a30431f848401011fcbf2ab4c04c4&fileId=db3a30432d9b3066012db872f12d0bb7; FOOTPRINT_VARIANT_NAME_0: Manufacturer Recommended; GREEN: true; HALOGEN_FREE: true; IF_MAX: 500Â mA; IMPORTED: yes; IMPORTED_FROM: vault; IMPORT_TS: 1521842213; MF: Infineon; MOUNTING_TECHNOLOGY: Surface Mount; MPN: BAS3005A-02V; PACKAGE: SC79; PACKAGE_DESCRIPTION: 2-Pin Semiconductor Package, 0.8 x 1.2 mm Body; PACKING: Reel; PREFIX: D; RELEASE_DATE: 1409237543; VAULT_GUID: EDAD54E0-67A3-4491-B804-28965AC47742; VAULT_REVISION: E1FDBEC9-D20E-4450-8851-E2B6A9887AF8; VF_MAX: 500Â V; VR_MAX: 30Â V
D3 D6 D9 = diode:BAV21: DIODE high-voltage general purpose diode
R1-R10 R12-R16 = rcl:R-EU_: RESISTOR, European symbol; SPICEPREFIX: R
U1-U3 = IRSM005-800MH:IRSM005-800MH: Half Bridge Driver AC Motors, DC Motors, DC-DC Converters, General Purpose Power MOSFET 27-PQFN (7x8); AUTOMOTIVE: No; CENTROID_NOT_SPECIFIED: No; DATASHEET: https://www.infineon.com/dgdl/Infineon-IRSM005-800MH-DS-v01_00-EN.pdf?fileId=5546d462533600a40153567bc6b52862; DEVICE_CLASS_L1: Integrated Circuits (ICs); DEVICE_CLASS_L2: Power Management ICs; DEVICE_CLASS_L3: Gate Drivers; DIGIKEY_DESCRIPTION: IC GATE DRIVER 40V QFN; DIGIKEY_PART_NUMBER: IRSM005-800MH-ND; FALL_TIME: 26ns; FOOTPRINT_URL: https://www.infineon.com/dgdl/Infineon-CIPOS_Nano_QFN-based_IPM-AN-v02_00-EN.pdf?fileId=5546d462533600a40153559abbe91132; FOOTPRINT_VARIANT_NAME_0: Recommended_Land_Pattern; HEIGHT: 1mm; LEAD_FREE: Yes; MAX_JUNCTION_TEMP: +150°C; MAX_POWER_DISSIPATION: 13W; MAX_SUPPLY_VOLTAGE: 20V; MF: Infineon; MFG_PACKAGE_IDENT: PG-IQFN-27; MFG_PACKAGE_IDENT_DATE: 0; MFG_PACKAGE_IDENT_REV: 901; MIN_SUPPLY_VOLTAGE: 10V; MOUSER_DESCRIPTION: Ipm Module, Mosfet, 80A, 40V, Pqfn Rohs Compliant: Yes; MOUSER_PART_NUMBER: 942-IRSM005-800MH; MPN: IRSM005-800MH; NOMINAL_SUPPLY_CURRENT: 45-250uA; NUMBER_OF_DRIVERS: 1; NUMBER_OF_OUTPUTS: 1; PACKAGE: QFN 7x8; PREFIX: U; RISE_TIME: 37ns; ROHS: Yes; STANDOFF_HEIGHT: 0mm; TEMPERATURE_RANGE_HIGH: +150°C; TURN_OFF_DELAY_TIME: 33ns; TURN_ON_DELAY_TIME: 11ns; VERIFICATION_VERSION: 0.0.0.3
U6 U7 = Allegro MicroSystems LLC - ACS70331EESATR-005B3:ALLEGRO_MICROSYSTEMS_LLC_ACS70331EESATR-005B3: Current Sensor 5A Channel Hall Effect, Open Loop Bidirectional 12-PowerWQFN; ACCURACY: 2%; AMBIENT_TEMPERATURE_RANGE_HIGH: +85°C; AMBIENT_TEMPERATURE_RANGE_LOW: -40°C; AUTOMOTIVE: No; CENTROID_NOT_SPECIFIED: No; CURRENT_SENSITIVITY: 200mV/A; DATASHEET: https://www.allegromicro.com/-/media/files/datasheets/acs70331-datasheet.ashx; DEVICE_CLASS_L1: Sensors; DEVICE_CLASS_L2: Current Sensors; DEVICE_CLASS_L3: unset; DIGIKEY_DESCRIPTION: HIGH SENSITIVITY, 1 MHZ, GMR-BAS; DIGIKEY_PART_NUMBER: 620-1887-1-ND; FOOTPRINT_VARIANT_NAME_0: Recommended_Land_Pattern; HEIGHT: 0.8mm; LEAD_FREE: Yes; MAX_JUNCTION_TEMP: +100°C; MAX_SENSING_CURRENT: 5A; MAX_SUPPLY_VOLTAGE: 4.5V; MF: Allegro MicroSystems LLC; MFG_PACKAGE_IDENT: ES-12; MFG_PACKAGE_IDENT_COMPONENT_ID: 18bcbf5156f7d6ef; MFG_PACKAGE_IDENT_DATE: 0; MFG_PACKAGE_IDENT_REV: 0; MIN_SUPPLY_VOLTAGE: 3V; MPN: ACS70331EESATR-005B3; OPERATING_SUPPLY_CURRENT: 4.5mA; PACKAGE: QFN12; PREFIX: U; ROHS: Yes; SENSING_METHOD: Hall Effect; SENSOR_OUTPUT: Analog Voltage; STANDOFF_HEIGHT: 0mm; TEMPERATURE_RANGE_HIGH: +85°C; TEMPERATURE_RANGE_LOW: -40°C; VERIFICATION_VERSION: 0.0.0.3

## Module POWER
Ports: GND(pwr) +5V(pwr) +15V(pwr) +24V(pwr) 3V3_CURRENT(pwr) 3V3_MICRO(pwr) 5V_TORQUE(pwr) VIN(pwr)
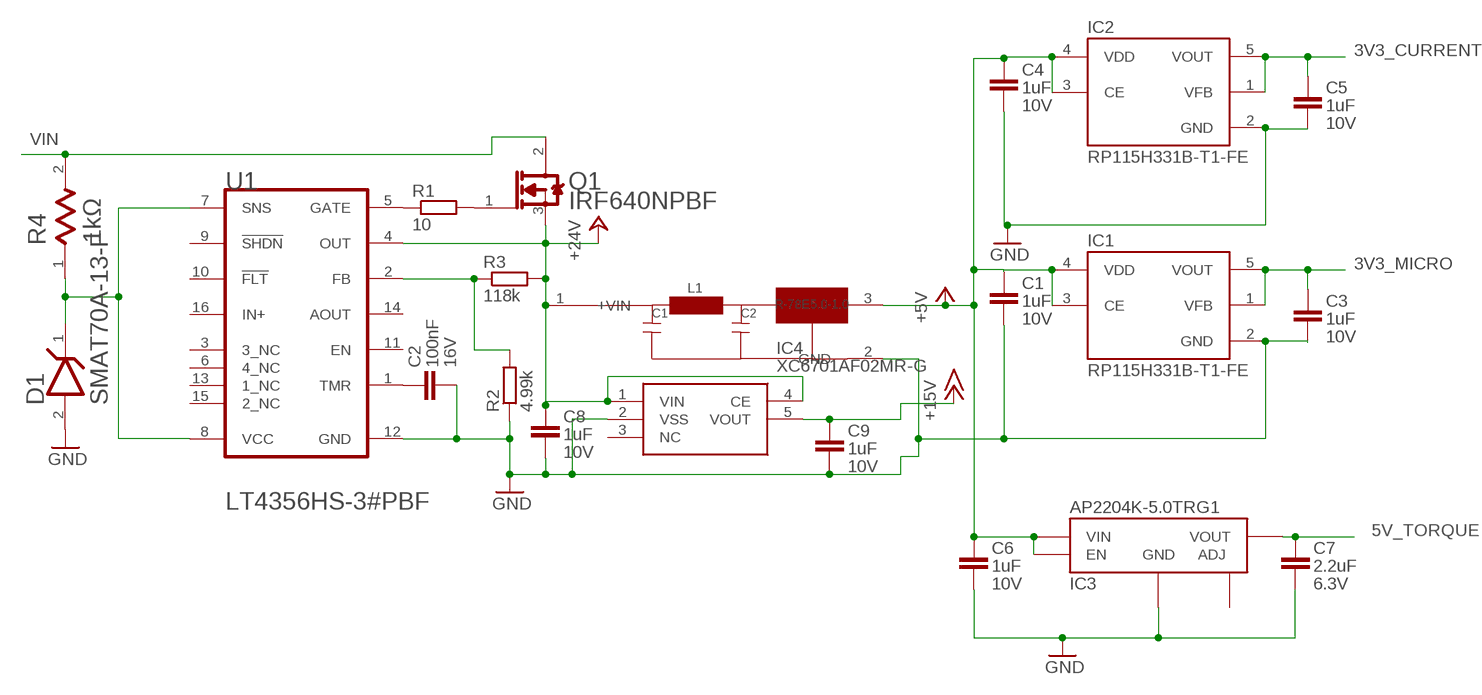
[diagram p3: schematic, module POWER, sheet 1]

### Parts
C1  GCM155C71A105KE38D  [C0402]
C2  GCM155R71C104JA55  [C0402]
C3  GCM155C71A105KE38D  [C0402]
C4  GCM155C71A105KE38D  [C0402]
C5  GCM155C71A105KE38D  [C0402]
C6  GCM155C71A105KE38D  [C0402]
C7  GRM155C80J225KE95D  [C0402]
C8  GCM155C71A105KE38D  [C0402]
C9  GCM155C71A105KE38D  [C0402]
D1  DIODES_SMAT70A-13-FDIODES_SMAT70A-13-F_0_0  [DIODES_SMAT70A-13-F_0]
IC1  RP115H331B-T1-FE  [SOT-89-5]
IC2  RP115H331B-T1-FE  [SOT-89-5]
IC3  AP2204K-5.0TRG1  [SOT-23-5]
IC4  XC6701AF02MR-G  [SOT95P280X130-5N]
Q1  INFINEON_IRF640NPBFINFINEON_IRF640NPBF_0_0  [INFINEON_IRF640NPBF_0]
R1  10  R-EU_R0402  [R0402]
R2  4.99k  R-EU_R0402  [R0402]
R3  118k  R-EU_R0402  [R0402]
R4  VISHAY_CRCW12181K00FKEKVISHAY_CRCW12181K00FKEK_0_0  [VISHAY_CRCW12181K00FKEK_0]
U1  LINEAR_TECHNOLOGY_LT4356HS-3#PBFLINEAR_TECHNOLOGY_LT4356HS-3#PBF_0_0  [LINEAR_TECHNOLOGY_LT4356HS-3#PBF_0]
U4  RECOM_R-78E5.0-1.0RECOM_R-78E5.0-1.0_0_0  [RECOM_R-78E5.0-1.0_0]

### Nets
3V3_CURRENT: C5.1 IC2.1(VFB) IC2.5(VOUT)
3V3_MICRO: C3.1 IC1.1(VFB) IC1.5(VOUT)
5V_TORQUE: C7.1 IC3.5(VOUT)
+5V [pwr]: C1.1 C4.1 C6.1 IC1.3(CE) IC1.4(VDD) IC2.3(CE) IC2.4(VDD) IC3.1(VIN) IC3.3(EN) U4.3(+VOUT)
+15V [pwr]: C9.1 IC4.5(VOUT)
+24V [pwr]: C8.1 IC4.1(VIN) IC4.4(CE) Q1.3(SOURCE) R3.2 U1.4(OUT) U4.1(+VIN)
FB_LT4356 [analog]: R2.2 R3.1 U1.2(FB)
GND [pwr]: C1.2 C2.2 C3.2 C4.2 C5.2 C6.2 C7.2 C8.2 C9.2 D1.2(ANODE) IC1.2(GND) IC2.2(GND) IC3.2(GND) IC4.2(VSS) R2.1 U1.12(GND) U4.2(GND)
N$1: R1.1 U1.5(GATE)
N$2: Q1.1(GATE) R1.2
N$5: C2.1 U1.1(TMR)
VCC/SNS_LT4356 [analog]: D1.1(CATHODE) R4.1 U1.7(SNS) U1.8(VCC)
VIN [pwr]: Q1.2(DRAIN) R4.2
Unconnected: IC3.4(ADJ) IC4.3(NC) U1.3(3_NC) U1.6(4_NC) U1.9(!SHDN!) U1.10(!FLT!) U1.11(EN) U1.13(1_NC) U1.14(AOUT) U1.15(2_NC) U1.16(IN+)

### Library data of the parts
C1 C3-C6 C8 C9 = msrm:GCM?C7*: Multilayer Ceramic Capacitors; CAPACITANCE: 1uF; DIGIKEY: 490-13409-1-ND; TOLERANCE: ±10%; VOLTAGE: 10V
C2 = msrm:GCM?R7*: Multilayer Ceramic Capacitors; CAPACITANCE: 100nF; DIGIKEY: 490-16433-1-ND; TOLERANCE: ±5%; VOLTAGE: 16V
C7 = msrm:GRM?C8*: CAP CER 10UF 6.3V X6S 0402 package: C0402 : 10µF ___ Source: Digikey <https://www.digikey.de/products/en?keywords=490-13233-1-ND> ; Datasheet <https://search.murata.co.jp/Ceramy/image/img/A01X/G101/ENG/GRM155C80J106ME11-01.pdf> 2.2µF ___ Source: Digikey <https://www.digikey.de/products/en?keywords=490-10012-1-ND> ; Datasheet <https://search.murata.co.jp/Ceramy/image/img/A01X/G101/ENG/GRM155C80J225KE95-01.pdf> 4.7µF ___ Source: Digikey <https://www.digikey.de/products/en?keywords=490-14458-1-ND> ; Datasheet <https://search.murata.co.jp/Ceramy/image/img/A01X/G101/ENG/GRM155C80J475MEAA-01.pdf>; CAPACITANCE: 2.2uF; DIGIKEY: 490-10012-1-ND; TOLERANCE: ±10%; VOLTAGE: 6.3V
D1 = Diodes - SMAT70A-13-F:DIODES_SMAT70A-13-F: TVS DIODE 70VWM 100VC SMA; BREAKDOWN_VOLTAGE: 77.8V; CAPACITANCE: 140pF; CENTROID_NOT_SPECIFIED: No; CLAMPING_VOLTAGE: 100V; DATASHEET: https://www.diodes.com/assets/Datasheets/ds30213.pdf; DEVICE_CLASS_L1: Circuit Protection; DEVICE_CLASS_L2: TVS Diodes; DEVICE_CLASS_L3: unset; DIGIKEY_DESCRIPTION: DIODE TVS DIODE 70V 100V SMA; DIGIKEY_PART_NUMBER: SMAT70A-FDICT-ND; DIRECTION: Unidirectional; FOOTPRINT_URL: https://www.diodes.com/assets/Package-Files/SMA.pdf; HEIGHT: 2.4mm; LEAD_FREE: yes; MAX_JUNCTION_TEMP: +150°C; MF: Diodes; MFG_PACKAGE_IDENT: SMA; MFG_PACKAGE_IDENT_DATE: 03/2017; MFG_PACKAGE_IDENT_REV: 0; MOUSER_DESCRIPTION: TVS Diodes - Transient Voltage Suppressors 400W 70V; MOUSER_PART_NUMBER: 621-SMAT70A-13-F; MPN: SMAT70A-13-F; NUMBER_OF_CHANNELS: 1; PACKAGE: SMA; PEAK_PULSE_CURRENT: 3.5A; PREFIX: D; REVERSE_STANDOFF_VOLTAGE: 70V; ROHS: yes; STANDOFF_HEIGHT: 0.05mm; TEMPERATURE_RANGE_HIGH: +150°C; TEMPERATURE_RANGE_LOW: -55°C; VERIFICATION_VERSION: 0.0.0.1
IC1 IC2 = msrm:RP115H*-T1-FE: Linear Voltage Regulator IC 1 Output 1A SOT-89-5 package: SOT-89-5 : H331B ___ Source: Digikey <https://www.digikey.de/products/en?keywords=RP115H331B-T1-FE> ; Datasheet <https://www.n-redc.co.jp/en/pdf/datasheet/rp115-ea.pdf> H331D ___ Source: Digikey <https://www.digikey.de/product-detail/en/ricoh-electronic-devices-co-ltd/RP115H331D-T1-FE/2129-RP115H331D-T1-FECT-ND/11569386> ; Datasheet <https://www.n-redc.co.jp/en/pdf/datasheet/rp115-ea.pdf>; DIGIKEY: RP115H331B-T1-FE-ND; VOLTAGE: 3.3V
IC3 = msrm:AP2204?-*TRG1: Linear Voltage Regulator IC 1 Output 150mA SOT-23-5 package: SOIC : APM2204MP-ADJTRG1DICT-ND ___ Source: Digikey <https://www.digikey.de/products/de?keywords=AP2204MP-ADJTRG1DICT-ND> ; Datasheet <https://media.digikey.com/pdf/Data%20Sheets/Diodes%20PDFs/AP2204_Jan2020.pdf> package: SOT-23-5 : 1.5TRG1 ___ Source: Digikey <https://www.digikey.de/product-detail/en/diodes-incorporated/AP2204K-1-5TRG1/AP2204K-1-5TRG1-ND/5305710?cur=EUR&lang=en> ; Datasheet <https://media.digikey.com/pdf/Data%20Sheets/Diodes%20PDFs/AP2204_Jan2020.pdf> 1.8TRG1 ___ Source: Digikey <https://www.digikey.de/product-detail/en/diodes-incorporated/AP2204K-1-5TRG1/AP2204K-1-5TRG1-ND/5305710?cur=EUR&lang=en> ; Datasheet <https://media.digikey.com/pdf/Data%20Sheets/Diodes%20PDFs/AP2204_Jan2020.pdf> 2.5TRG1 ___ Source: / 2.8TRG1 ___ Source: / 3.0TRG1 ___ Source: Digikey <https://www.digikey.de/products/de?keywords=AP2204K-3.0TRG1DICT-ND> ; Datasheet <https://media.digikey.com/pdf/Data%20Sheets/Diodes%20PDFs/AP2204_Jan2020.pdf> 3.3TRG1 ___ Source: Digikey <https://www.digikey.de/products/de?keywords=AP2204K-3.3TRG1DICT-ND> ; Datasheet <https://media.digikey.com/pdf/Data%20Sheets/Diodes%20PDFs/AP2204_Jan2020.pdf> 5.0RG1 ___ Source: Digikey <https://www.digikey.de/products/de?keywords=AP2204K-5.0TRG1DICT-ND> ; Datasheet <https://media.digikey.com/pdf/Data%20Sheets/Diodes%20PDFs/AP2204_Jan2020.pdf> ADJTRG1 ___ Source: Digikey <https://www.digikey.de/products/de?keywords=AP2204K-ADJTRG1DICT-ND> ; Datasheet <https://media.digikey.com/pdf/Data%20Sheets/Diodes%20PDFs/AP2204_Jan2020.pdf>; DIGIKEY: AP2204K-5.0TRG1DICT-ND
IC4 = XC6701AF02MR-G:XC6701AF02MR-G: LDO Voltage Regulators 28V High Speed Voltage Regulator Source: Datasheet <https://www.torexsemi.com/file/xc6701/XC6701.pdf>; DESCRIPTION: LDO Voltage Regulators 28V High Speed Voltage Regulator; HEIGHT: 1.3mm; MANUFACTURER_NAME: Torex; MANUFACTURER_PART_NUMBER: XC6701AF02MR-G; MOUSER_PART_NUMBER: 865-XC6701AF02MR-G; MOUSER_PRICE-STOCK: https://www.mouser.co.uk/ProductDetail/Torex-Semiconductor/XC6701AF02MR-G?qs=AsjdqWjXhJ%252B8LlIUcKkGEA%3D%3D
Q1 = Infineon - IRF640NPBF:INFINEON_IRF640NPBF: Trans MOSFET N-CH 200V 18A 3-Pin(3+Tab) TO-220AB; CENTROID_NOT_SPECIFIED: No; CONTINUOUS_DRAIN_CURRENT: 18A; DATASHEET: https://www.infineon.com/dgdl/irf640npbf.pdf?fileId=5546d462533600a4015355e7be9019ee; DEVICE_CLASS_L1: Discrete Semiconductors; DEVICE_CLASS_L2: Transistors; DEVICE_CLASS_L3: MOSFETs; DIGIKEY_DESCRIPTION: TRANS MOSFET N-CH 200V 18A TO-220AB; DIGIKEY_PART_NUMBER: IRF640NPBF-ND; DRAIN_TO_SOURCE_BREAKDOWN_VOLTAGE: 200V; DRAIN_TO_SOURCE_RESISTANCE: 0.15Ω; DRAIN_TO_SOURCE_VOLTAGE: 200V; FOOTPRINT_PARAMETERS_0: {"fp_type":"TO220","params":{"N":{"long name":"Number of leads","type":"fixed","short name":"N","value":3},"A":{"nom":false,"long name":"Total height","min":13970000,"max":14220000,"short name":"A","type":"measurement"},"A1":{"nom":false,"long name":"Package clearance","min":3370000,"max":3670000,"short name":"A1","type":"measurement"},"D":{"nom":false,"long name":"Package length","min":false,"max":10750000,"short name":"D","type":"measurement"},"E":{"nom":false,"long name":"Package width","min":false,"max":4830000,"short name":"E","type":"measurement"},"B":{"nom":false,"long name":"Lead width","min":610000,"max":940000,"short name":"B","type":"measurement"},"C":{"nom":false,"long name":"Lead thickness","min":330000,"max":630000,"short name":"C","type":"measurement"},"e":{"nom":2540000,"long name":"Lead pitch","min":null,"max":null,"short name":"e","type":"measurement"},"offset x":{"nom":0,"long name":"X Center offset","min":null,"max":null,"short name":"offset x","type":"measurement"},"offset y":{"nom":0,"long name":"Y Center offset","min":null,"max":null,"short name":"offset y","type":"measurement"},"LS":{"default":"Circle","long name":"Land shape","type":"multichoice","short name":"LS"},"LS1":{"default":"Square","long name":"Land shape (Pin 1)","type":"multichoice","short name":"LS1"}}}; FOOTPRINT_URL: https://www.infineon.com/dgdl/po-to220ab-fp.pdf?fileId=5546d462580663ef0158068cfbee01be; GATE_TO_SOURCE_VOLTAGE: 20V; HEIGHT: 19.8mm; INPUT_CAPACITACE_AT_VDS: 1160pF @ 25V; IPC_LAND_PATTERN_NAME: TO-220; LEAD_FREE: yes; MAX_JUNCTION_TEMP: +175°C; MF: Infineon; MFG_PACKAGE_IDENT: PG-TO220-3; MFG_PACKAGE_IDENT_DATE: 0; MFG_PACKAGE_IDENT_REV: 904; MOUSER_PART_NUMBER: 942-IRF640NPBF; MPN: IRF640NPBF; NUMBER_OF_CHANNELS: 1; NUMBER_OF_N_CHANNELS: 1; PACKAGE: TO220; POWER_DISSIPATION: 150W; PREFIX: Q; ROHS: yes; STANDOFF_HEIGHT: 3.37mm; TECHNOLOGY: MOSFET; TEMPERATURE_RANGE_HIGH: +175°C; TEMPERATURE_RANGE_LOW: -55°C; THRESHOLD_VGS: 2V; TURN_OFF_DELAY_TIME: 23ns; TURN_ON_DELAY_TIME: 10ns; VERIFICATION_VERSION: 0.0.0.1
R1-R3 = rcl:R-EU_: RESISTOR, European symbol; SPICEPREFIX: R
R4 = Vishay - CRCW12181K00FKEK:VISHAY_CRCW12181K00FKEK: RES Thick Film, 1kΩ, 1%, 1W, 100ppm/°C, 1218; AUTOMOTIVE: Yes; AUTOMOTIVE_GRADE: Grade 0; CENTROID_NOT_SPECIFIED: No; COMPOSITION: Thick Film; DATASHEET: http://www.vishay.com/docs/20035/dcrcwe3.pdf; DEVICE_CLASS_L1: Passive Components; DEVICE_CLASS_L2: Resistors; DEVICE_CLASS_L3: Chip SMD Resistors; FOOTPRINT_PARAMETERS_1: {"fp_type":"chip_res","params":{"L":{"nom":3200000,"long name":"Length","min":3000000,"max":3300000,"short name":"L","type":"measurement"},"W":{"nom":4600000,"long name":"Width","min":4450000,"max":4750000,"short name":"W","type":"measurement"},"t":{"nom":550000,"long name":"Height","min":500000,"max":600000,"short name":"t","type":"measurement"},"b":{"nom":450000,"long name":"Terminal width","min":250000,"max":650000,"short name":"b","type":"measurement"},"P":{"default":"false","long name":"Polarized","type":"multichoice","short name":"P"},"offset x":{"nom":0,"long name":"X Center offset","min":null,"max":null,"short name":"offset x","type":"measurement"},"offset y":{"nom":0,"long name":"Y Center offset","min":null,"max":null,"short name":"offset y","type":"measurement"},"LS":{"long name":"Land shape","type":"fixed","short name":"LS","value":"Rectangle"},"solder toe":{"nom":550000,"long name":"Solder fillet (toe)","min":null,"max":null,"short name":"solder toe","type":"fixedmeasurement"},"solder heel":{"nom":0,"long name":"Solder fillet (heel)","min":null,"max":null,"short name":"solder heel","type":"fixedmeasurement"},"solder side":{"nom":50000,"long name":"Solder fillet (side)","min":null,"max":null,"short name":"solder side","type":"fixedmeasurement"},"courtyard":{"nom":500000,"long name":"Courtyard","min":null,"max":null,"short name":"courtyard","type":"fixedmeasurement"},"SF":{"default":"A (>= 1608 metric)","long name":"Packing level","type":"multichoiceparent","short name":"SF","help":"http://support.upverter.com/customer/portal/articles/978783-what-is-a-footprint-packing-level","children":["solder toe","solder heel","solder side","courtyard"]}}}; FOOTPRINT_PARAMETERS_2: {"fp_type":"chip_res","params":{"L":{"nom":3200000,"long name":"Length","min":3000000,"max":3300000,"short name":"L","type":"measurement"},"W":{"nom":4600000,"long name":"Width","min":4450000,"max":4750000,"short name":"W","type":"measurement"},"t":{"nom":550000,"long name":"Height","min":500000,"max":600000,"short name":"t","type":"measurement"},"b":{"nom":450000,"long name":"Terminal width","min":250000,"max":650000,"short name":"b","type":"measurement"},"P":{"default":"false","long name":"Polarized","type":"multichoice","short name":"P"},"offset x":{"nom":0,"long name":"X Center offset","min":null,"max":null,"short name":"offset x","type":"measurement"},"offset y":{"nom":0,"long name":"Y Center offset","min":null,"max":null,"short name":"offset y","type":"measurement"},"LS":{"long name":"Land shape","type":"fixed","short name":"LS","value":"Rectangle"},"solder toe":{"nom":350000,"long name":"Solder fillet (toe)","min":null,"max":null,"short name":"solder toe","type":"fixedmeasurement"},"solder heel":{"nom":0,"long name":"Solder fillet (heel)","min":null,"max":null,"short name":"solder heel","type":"fixedmeasurement"},"solder side":{"nom":0,"long name":"Solder fillet (side)","min":null,"max":null,"short name":"solder side","type":"fixedmeasurement"},"courtyard":{"nom":250000,"long name":"Courtyard","min":null,"max":null,"short name":"courtyard","type":"fixedmeasurement"},"SF":{"default":"B (>= 1608 metric)","long name":"Packing level","type":"multichoiceparent","short name":"SF","help":"http://support.upverter.com/customer/portal/articles/978783-what-is-a-footprint-packing-level","children":["solder toe","solder heel","solder side","courtyard"]}}}; FOOTPRINT_PARAMETERS_3: {"fp_type":"chip_res","params":{"L":{"nom":3200000,"long name":"Length","min":3000000,"max":3300000,"short name":"L","type":"measurement"},"W":{"nom":4600000,"long name":"Width","min":4450000,"max":4750000,"short name":"W","type":"measurement"},"t":{"nom":550000,"long name":"Height","min":500000,"max":600000,"short name":"t","type":"measurement"},"b":{"nom":450000,"long name":"Terminal width","min":250000,"max":650000,"short name":"b","type":"measurement"},"P":{"default":"false","long name":"Polarized","type":"multichoice","short name":"P"},"offset x":{"nom":0,"long name":"X Center offset","min":null,"max":null,"short name":"offset x","type":"measurement"},"offset y":{"nom":0,"long name":"Y Center offset","min":null,"max":null,"short name":"offset y","type":"measurement"},"LS":{"long name":"Land shape","type":"fixed","short name":"LS","value":"Rectangle"},"solder toe":{"nom":150000,"long name":"Solder fillet (toe)","min":null,"max":null,"short name":"solder toe","type":"fixedmeasurement"},"solder heel":{"nom":0,"long name":"Solder fillet (heel)","min":null,"max":null,"short name":"solder heel","type":"fixedmeasurement"},"solder side":{"nom":-50000,"long name":"Solder fillet (side)","min":null,"max":null,"short name":"solder side","type":"fixedmeasurement"},"courtyard":{"nom":100000,"long name":"Courtyard","min":null,"max":null,"short name":"courtyard","type":"fixedmeasurement"},"SF":{"default":"C (>= 1608 metric)","long name":"Packing level","type":"multichoiceparent","short name":"SF","help":"http://support.upverter.com/customer/portal/articles/978783-what-is-a-footprint-packing-level","children":["solder toe","solder heel","solder side","courtyard"]}}}; FOOTPRINT_VARIANT_NAME_0: Recommended_Land_Pattern; FOOTPRINT_VARIANT_NAME_1: IPC_A; FOOTPRINT_VARIANT_NAME_2: IPC_B; FOOTPRINT_VARIANT_NAME_3: IPC_C; HEIGHT: 0.6mm; IPC_LAND_PATTERN_NAME: RESC320460X55; LEAD_FREE: Yes; MF: Vishay; MFG_PACKAGE_IDENT: CRCW1218-e3; MFG_PACKAGE_IDENT_COMPONENT_ID: 456d41f10116fe40; MFG_PACKAGE_IDENT_DATE: 0; MFG_PACKAGE_IDENT_REV: 0; MPN: CRCW12181K00FKEK; PACKAGE: 1218; POWER_RATING: 1W; PREFIX: R; RESISTANCE: 1kΩ; ROHS: Yes; SERIES: CRCW e230; TEMPERATURE_COEFFICIENT: 100ppm/°C; TEMPERATURE_RANGE_HIGH: +155°C; TEMPERATURE_RANGE_LOW: -55°C; TOLERANCE: 1%; VERIFICATION_VERSION: 0.0.0.3; VOLTAGE_RATING: 200V
U1 = Linear Technology - LT4356HS-3#PBF:LINEAR_TECHNOLOGY_LT4356HS-3#PBF: LT-LT4356-3-S-16; ACTIVE_LIMITING: yes; CIIVA_IDS: 280457; CIRCUIT_BREAKERS: 1; CIRCUIT_BREAKER_ACCURACY: 10; CIRCUIT_BREAKER_THRESHOLD: 50 mV; COMPONENT_LINK_1_DESCRIPTION: Manufacturer URL; COMPONENT_LINK_1_URL: http://www.linear.com/; COMPONENT_LINK_3_DESCRIPTION: Package Specification; COMPONENT_LINK_3_URL: http://cds.linear.com/docs/en/packaging/S16%2005-08-1610%20Rev%20G.pdf; DATASHEET: http://cds.linear.com/docs/en/datasheet/43563fb.pdf; DATASHEET_VERSION: Rev. B; EXTENDED_TEMP: C, I, H, MP; FAST_COMPARATOR: no; FAULT: no; FOLDBACK: yes; FOOTPRINT_VARIANT_NAME_0: Level C; FOOTPRINT_VARIANT_NAME_1: Level B; FOOTPRINT_VARIANT_NAME_2: Level A; IMPORTED: yes; IMPORTED_FROM: vault; IMPORT_TS: 1521846764; IN_RUSH_CURRENT: Ramp; MF: Linear Technology; MOUNTING_TECHNOLOGY: Surface Mount; MPN: LT4356HS-3#PBF; PACKAGE: S-16; PACKAGE_DESCRIPTION: 16-Pin Plastic Small Outline, Body 9.9 x 3.9 mm, Pitch 1.27 mm; PACKAGE_VERSION: Rev. G, 05/2012; POWER_GOOD: no; PREFIX: U; RELEASE_DATE: 1377783357; RESET: no; ROHS: Yes; VAULT_GUID: AF2ADA32-0417-48BB-B611-3DAE758AA892; VAULT_REVISION: 7C1DD302-AD26-4490-B5F0-A8D2873D3302; VIN_RANGE: 4 to 80 V
U4 = RECOM - R-78E5.0-1.0:RECOM_R-78E5.0-1.0: Non-Isolated DC/DC Converters 8-28Vin 5V 1.0A THRU; CENTROID_NOT_SPECIFIED: No; DATASHEET: https://www.recom-power.com/pdf/Innoline/R-78Exx-1.0.pdf; DEVICE_CLASS_L1: Integrated Circuits (ICs); DEVICE_CLASS_L2: Power Management ICs; DEVICE_CLASS_L3: Voltage Regulators - Switching; DIGIKEY_DESCRIPTION: IC DC DC CONVERTER 5V 5W; DIGIKEY_PART_NUMBER: 945-2201-ND; HEIGHT: 10.9mm; LEAD_FREE: yes; MAX_POWER_DISSIPATION: 5W; MAX_SUPPLY_VOLTAGE: 28V; MF: RECOM; MFG_PACKAGE_IDENT: R-78E5.0-1.0; MFG_PACKAGE_IDENT_DATE: 0; MFG_PACKAGE_IDENT_REV: 0; MIN_SUPPLY_VOLTAGE: 8V; MOUSER_DESCRIPTION: 1A DC/DC-Converter 'INNOLINE' SIP3 reg; V. In: 8-28; V. Out: 5.0; mA. Out: 1000; MOUSER_PART_NUMBER: 919-R-78E5.0-1.0; MPN: R-78E5.0-1.0; NOMINAL_SUPPLY_CURRENT: 1.5mA; NUMBER_OF_OUTPUTS: 1; OUTPUT_CURRENT: 1A; OUTPUT_VOLTAGE: 5V; PACKAGE: SIP3; PREFIX: U; ROHS: yes; STANDOFF_HEIGHT: 0.26mm; SWITCHING_FREQUENCY: 330kHz; SWITCHING_TOPOLOGY: Buck; TEMPERATURE_RANGE_HIGH: +85°C; TEMPERATURE_RANGE_LOW: -40°C; VERIFICATION_VERSION: 0.0.0.1

## Module ETHERCAT
Ports: ECAT_CS(in) ECAT_MISO(out) ECAT_MOSI(io) ECAT_SCK(in) ECAT_SQI2(io) ECAT_SQI3(io) V+(pwr) GND(pwr)
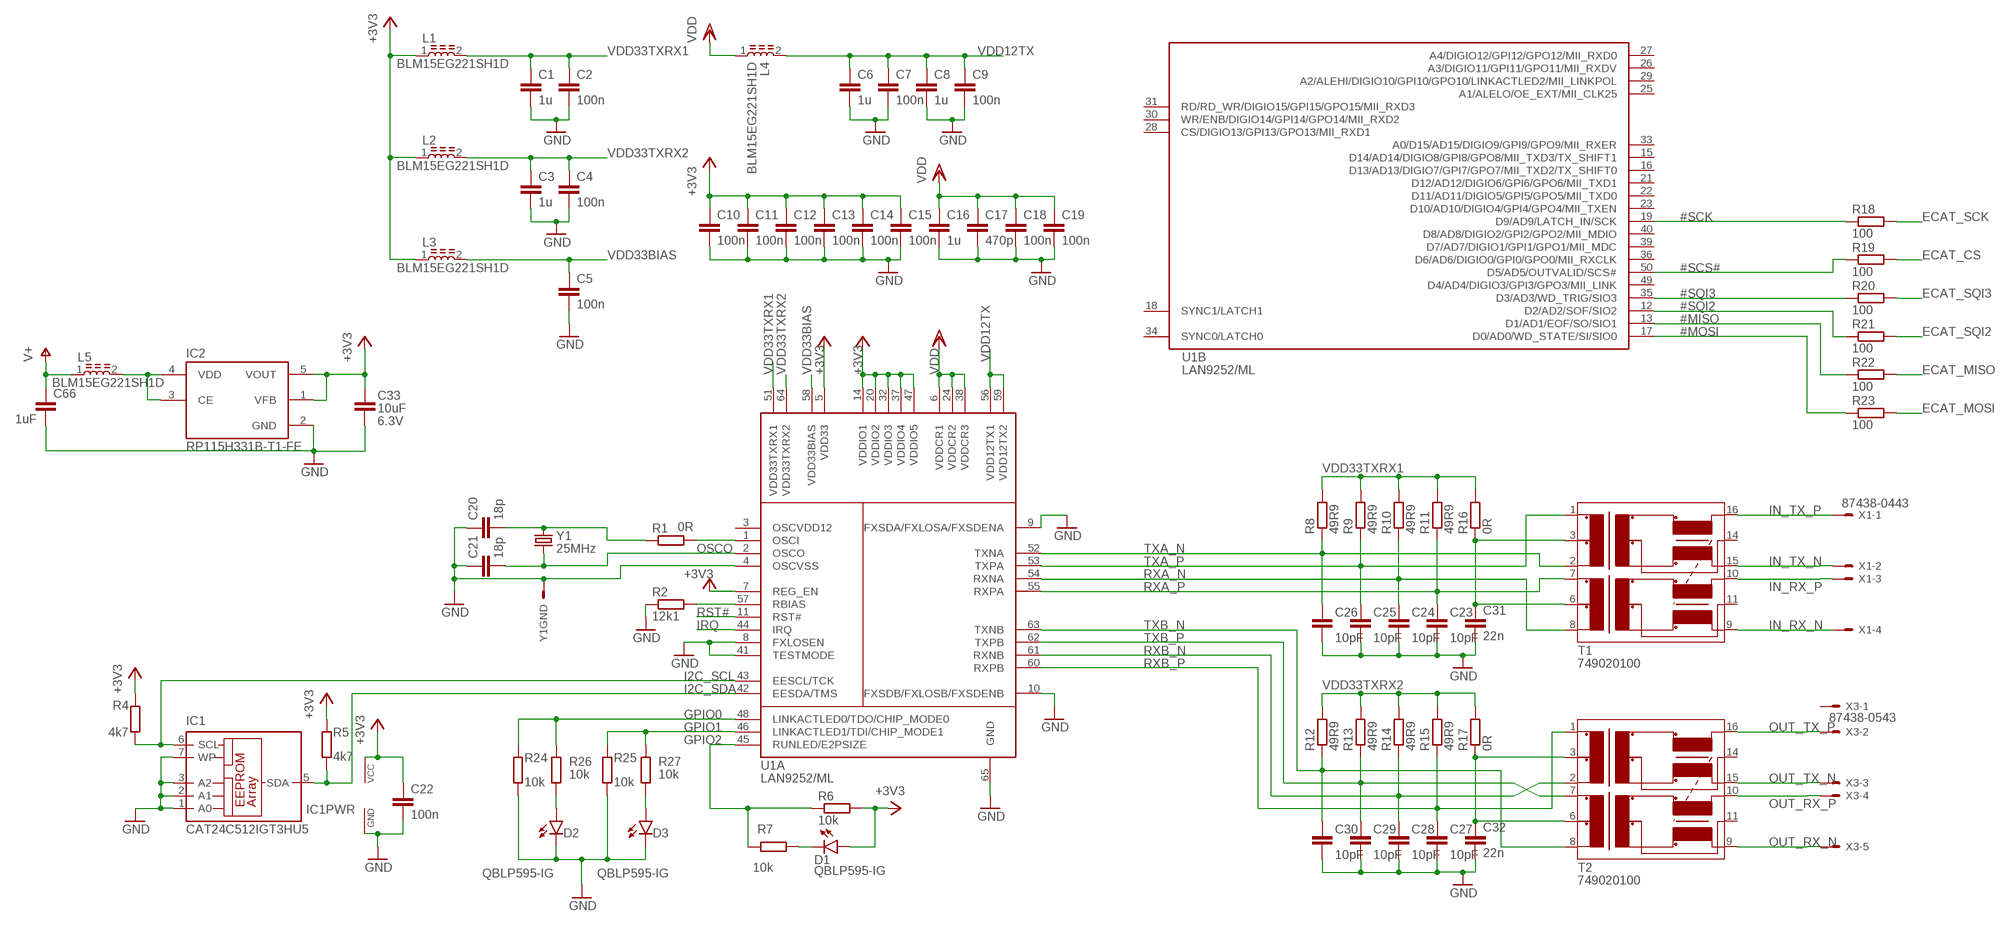
[diagram p4: schematic, module ETHERCAT, sheet 1]

### Parts
C1  1u  GCM155C71A105KE38D  [C0402]
C2  100n  GCM155R71C104JA55  [C0402]
C3  1u  GCM155C71A105KE38D  [C0402]
C4  100n  GCM155R71C104JA55  [C0402]
C5  100n  GCM155R71C104JA55  [C0402]
C6  1u  GCM155C71A105KE38D  [C0402]
C7  100n  GCM155R71C104JA55  [C0402]
C8  1u  GCM155C71A105KE38D  [C0402]
C9  100n  GCM155R71C104JA55  [C0402]
C10  100n  GCM155R71C104JA55  [C0402]
C11  100n  GCM155R71C104JA55  [C0402]
C12  100n  GCM155R71C104JA55  [C0402]
C13  100n  GCM155R71C104JA55  [C0402]
C14  100n  GCM155R71C104JA55  [C0402]
C15  100n  GCM155R71C104JA55  [C0402]
C16  1u  GCM155C71A105KE38D  [C0402]
C17  470p  GCM155R71H471KA37  [C0402]
C18  100n  GCM155R71C104JA55  [C0402]
C19  100n  GCM155R71C104JA55  [C0402]
C20  18p  GCM1555C1H180JA16  [C0402]
C21  18p  GCM1555C1H180JA16  [C0402]
C22  100n  GCM155R71C104JA55  [C0402]
C23  GCM1555C1H100JA16  [C0402]
C24  GCM1555C1H100JA16  [C0402]
C25  GCM1555C1H100JA16  [C0402]
C26  GCM1555C1H100JA16  [C0402]
C27  GCM1555C1H100JA16  [C0402]
C28  GCM1555C1H100JA16  [C0402]
C29  GCM1555C1H100JA16  [C0402]
C30  GCM1555C1H100JA16  [C0402]
C31  22n  GCM155R71E223KA55  [C0402]
C32  22n  GCM155R71E223KA55  [C0402]
C33  GRM155C80J106ME11D  [C0402]
C66  1uF  GCM155C71A105KE38D  [C0402]  (not fitted in variant +3V3)
D1  QBLP595-IG  [LED0402]
D2  QBLP595-IG  [LED0402]
D3  QBLP595-IG  [LED0402]
IC1  CAT24C512IGT3HU5  [UDFN8]
IC2  RP115H331B-T1-FE  [SOT-89-5]
L1  BLM15EG221SH1D  [BEAD0402]
L2  BLM15EG221SH1D  [BEAD0402]
L3  BLM15EG221SH1D  [BEAD0402]
L4  BLM15EG221SH1D  [BEAD0402]
L5  BLM15EG221SH1D  [BEAD0402]
R1  0R  RT0402FRE070RL  [R0402]
R2  12k1  RT0402FRE0712K1L  [R0402]
R4  4k7  RT0402FRE074K7L  [R0402]
R5  4k7  RT0402FRE074K7L  [R0402]
R6  10k  RT0402FRE0710KL  [R0402]
R7  RL0402FR-7W10KL  [R0402]
R8  49R9  RT0402FRE0749R9L  [R0402]
R9  49R9  RT0402FRE0749R9L  [R0402]
R10  49R9  RT0402FRE0749R9L  [R0402]
R11  49R9  RT0402FRE0749R9L  [R0402]
R12  49R9  RT0402FRE0749R9L  [R0402]
R13  49R9  RT0402FRE0749R9L  [R0402]
R14  49R9  RT0402FRE0749R9L  [R0402]
R15  49R9  RT0402FRE0749R9L  [R0402]
R16  0R  RT0402FRE070RL  [R0402]
R17  0R  RT0402FRE070RL  [R0402]
R18  100  RT0402FRE07100RL  [R0402]
R19  100  RT0402FRE07100RL  [R0402]
R20  100  RT0402FRE07100RL  [R0402]
R21  100  RT0402FRE07100RL  [R0402]
R22  100  RT0402FRE07100RL  [R0402]
R23  100  RT0402FRE07100RL  [R0402]
R24  10k  RT0402FRE0710KL  [R0402]
R25  10k  RT0402FRE0710KL  [R0402]
R26  RL0402FR-7W10KL  [R0402]
R27  RL0402FR-7W10KL  [R0402]
T1  749020100  [SOIC127P965X533-16-TRAFO]
T2  749020100  [SOIC127P965X533-16-TRAFO]
U1  LAN9252/ML  [QFN64-T600]
X1  87438-0443  [87438-04]
X3  87438-0543  [87438-05]
Y1  ECS-250-18-36B-CKY-TR  [ECX-2236]

### Nets
#MISO: R22.1 U1.13(B:D1/AD1/EOF/SO/SIO1)
#MOSI: R23.1 U1.17(B:D0/AD0/WD_STATE/SI/SIO0)
#SCK: R18.1 U1.19(B:D9/AD9/LATCH_IN/SCK)
#SCS#: R19.1 U1.50(B:D5/AD5/OUTVALID/SCS#)
#SQI2: R21.1 U1.12(B:D2/AD2/SOF/SIO2)
#SQI3: R20.1 U1.35(B:D3/AD3/WD_TRIG/SIO3)
+3V3 [power]: C10.1 C11.1 C12.1 C13.1 C14.1 C15.1 C22.1 C33.1 D1.2(A) IC1.8(VCC) IC2.1(VFB) IC2.5(VOUT) L1.1 L2.1 L3.1 R4.2 R5.2 R6.2 U1.5(A:VDD33) U1.7(A:REG_EN) U1.14(A:VDDIO1) U1.20(A:VDDIO2) U1.32(A:VDDIO3) U1.37(A:VDDIO4) U1.47(A:VDDIO5)
CT1: C31.1 R16.1 T1.3(RCT) T1.6(TCT)
CT2: C32.1 R17.1 T2.3(RCT) T2.6(TCT)
ECAT_CS: R19.2
ECAT_MISO: R22.2
ECAT_MOSI: R23.2
ECAT_SCK: R18.2
ECAT_SQI2: R21.2
ECAT_SQI3: R20.2
GND [power]: C1.2 C2.2 C3.2 C4.2 C5.2 C6.2 C7.2 C8.2 C9.2 C10.2 C11.2 C12.2 C13.2 C14.2 C15.2 C16.2 C17.2 C18.2 C19.2 C20.1 C21.1 C22.2 C23.2 C24.2 C25.2 C26.2 C27.2 C28.2 C29.2 C30.2 C31.2 C32.2 C33.2 C66.2 D2.1(C) D3.1(C) IC1.1(A0) IC1.2(A1) IC1.3(A2) IC1.4(GND) IC1.7(WP) IC1.9(GND) IC2.2(GND) R2.1 R24.1 R25.1 U1.4(A:OSCVSS) U1.8(A:FXLOSEN) U1.9(A:FXSDA/FXLOSA/FXSDENA) U1.10(A:FXSDB/FXLOSB/FXSDENB) U1.41(A:TESTMODE) U1.65(A:GND) Y1.2(S) Y1.4(S)
GPIO0: R24.2 R26.1 U1.48(A:LINKACTLED0/TDO/CHIP_MODE0)
GPIO1: R25.2 R27.1 U1.46(A:LINKACTLED1/TDI/CHIP_MODE1)
GPIO2: R6.1 R7.2 U1.45(A:RUNLED/E2PSIZE)
I2C_SCL: IC1.6(SCL) R4.1 U1.43(A:EESCL/TCK)
I2C_SDA: IC1.5(SDA) R5.1 U1.42(A:EESDA/TMS)
IN_RX_N: T1.9(TX-) X1.4
IN_RX_P: T1.10(TX+) X1.3
IN_TX_N: T1.15(RX-) X1.2
IN_TX_P: T1.16(RX+) X1.1
IRQ: U1.44(A:IRQ)
N$1: D2.2(A) R26.2
N$2: D3.2(A) R27.2
N$3: IC2.3(CE) IC2.4(VDD) L5.2
N$15: D1.1(C) R7.1
OSCI: R1.2 U1.1(A:OSCI)
OSCI1: C20.2 R1.1 Y1.3
OSCO: C21.2 U1.2(A:OSCO) Y1.1
OUT_RX_N: T2.9(TX-) X3.5
OUT_RX_P: T2.10(TX+) X3.4
OUT_TX_N: T2.15(RX-) X3.3
OUT_TX_P: T2.16(RX+) X3.2
RBIAS: R2.2 U1.57(A:RBIAS)
RST#: U1.11(A:RST#)
RXA_N: C24.1 R10.1 T1.8(TD-) U1.54(A:RXNA)
RXA_P: C23.1 R11.1 T1.7(TD+) U1.55(A:RXPA)
RXB_N: C28.1 R14.1 T2.2(RD-) U1.61(A:RXNB)
RXB_P: C27.1 R15.1 T2.1(RD+) U1.60(A:RXPB)
TXA_N: C26.1 R8.1 T1.2(RD-) U1.52(A:TXNA)
TXA_P: C25.1 R9.1 T1.1(RD+) U1.53(A:TXPA)
TXB_N: C30.1 R12.1 T2.8(TD-) U1.63(A:TXNB)
TXB_P: C29.1 R13.1 T2.7(TD+) U1.62(A:TXPB)
V+: C66.1 L5.1
VDD [power]: C16.1 C17.1 C18.1 C19.1 L4.1 U1.6(A:VDDCR1) U1.24(A:VDDCR2) U1.38(A:VDDCR3)
VDD12TX [power]: C6.1 C7.1 C8.1 C9.1 L4.2 U1.56(A:VDD12TX1) U1.59(A:VDD12TX2)
VDD33BIAS [power]: C5.1 L3.2 U1.58(A:VDD33BIAS)
VDD33TXRX1 [power]: C1.1 C2.1 L1.2 R8.2 R9.2 R10.2 R11.2 R16.2 U1.51(A:VDD33TXRX1)
VDD33TXRX2 [power]: C3.1 C4.1 L2.2 R12.2 R13.2 R14.2 R15.2 R17.2 U1.64(A:VDD33TXRX2)
Unconnected: T1.11(TXCT) T1.14(RXCT) T2.11(TXCT) T2.14(RXCT) U1.15(B:D14/AD14/DIGIO8/GPI8/GPO8/MII_TXD3/TX_SHIFT1) U1.16(B:D13/AD13/DIGIO7/GPI7/GPO7/MII_TXD2/TX_SHIFT0) U1.18(B:SYNC1/LATCH1) U1.21(B:D12/AD12/DIGIO6/GPI6/GPO6/MII_TXD1) U1.22(B:D11/AD11/DIGIO5/GPI5/GPO5/MII_TXD0) U1.23(B:D10/AD10/DIGIO4/GPI4/GPO4/MII_TXEN) U1.25(B:A1/ALELO/OE_EXT/MII_CLK25) U1.26(B:A3/DIGIO11/GPI11/GPO11/MII_RXDV) U1.27(B:A4/DIGIO12/GPI12/GPO12/MII_RXD0) U1.28(B:CS/DIGIO13/GPI13/GPO13/MII_RXD1) U1.29(B:A2/ALEHI/DIGIO10/GPI10/GPO10/LINKACTLED2/MII_LINKPOL) U1.30(B:WR/ENB/DIGIO14/GPI14/GPO14/MII_RXD2) U1.31(B:RD/RD_WR/DIGIO15/GPI15/GPO15/MII_RXD3) U1.33(B:A0/D15/AD15/DIGIO9/GPI9/GPO9/MII_RXER) U1.34(B:SYNC0/LATCH0) U1.36(B:D6/AD6/DIGIO0/GPI0/GPO0/MII_RXCLK) U1.39(B:D7/AD7/DIGIO1/GPI1/GPO1/MII_MDC) U1.40(B:D8/AD8/DIGIO2/GPI2/GPO2/MII_MDIO) U1.49(B:D4/AD4/DIGIO3/GPI3/GPO3/MII_LINK) X3.1

### Power pins joined to a net without a drawn wire
OSCVDD12: U1.3(A:OSCVDD12)

### Library data of the parts
C1 C3 C6 C8 C16 C66 = msrm:GCM?C7*: Multilayer Ceramic Capacitors; CAPACITANCE: 1uF; DIGIKEY: 490-13409-1-ND; TOLERANCE: ±10%; VOLTAGE: 10V
C2 C4 C5 C7 C9-C15 C18 C19 C22 = msrm:GCM?R7*: Multilayer Ceramic Capacitors; CAPACITANCE: 100nF; DIGIKEY: 490-16433-1-ND; TOLERANCE: ±5%; VOLTAGE: 16V
C17 = msrm:GCM?R7*: Multilayer Ceramic Capacitors; CAPACITANCE: 470pF; DIGIKEY: 490-4913-1-ND; TOLERANCE: ±10%; VOLTAGE: 50V
C20 C21 = msrm:GCM?5C*: Multilayer Ceramic Capacitors; CAPACITANCE: 18pF; DIGIKEY: 490-12650-1-ND; TOLERANCE: ±5%; VOLTAGE: 50V
C23-C30 = msrm:GCM?5C*: Multilayer Ceramic Capacitors; CAPACITANCE: 10pF; DIGIKEY: 490-10668-1-ND; TOLERANCE: ±5%; VOLTAGE: 50V
C31 C32 = msrm:GCM?R7*: Multilayer Ceramic Capacitors; CAPACITANCE: 22nF; DIGIKEY: 490-6044-1-ND; TOLERANCE: ±10%; VOLTAGE: 25V
C33 = msrm:GRM?C8*; CAPACITANCE: 10uF; DIGIKEY: 490-13233-1-ND; TOLERANCE: ±20%; VOLTAGE: 6.3V
D1-D3 = msrm:QBLP595-: LED; DIGIKEY: 1516-1216-1-ND
IC1 = msrm:CAT24C512: EEPROM Memory IC 512Kb (64K x 8) I²C 1MHz 400ns Source: Datasheet <http://www.onsemi.com/pub/Collateral/CAT24C512-D.PDF>; DIGIKEY: CAT24C512HU5IGT3OSCT-ND; LEAD_FINISH: NiPdAu; TEMPERATURE: -40°C ~ 85°C
IC2 = msrm:RP115H*-T1-FE: The RP115x is a CMOS-based positive voltage regulator featuring 500 mA/ 1.0 A that provides high ripple rejection, low dropout voltage, high output voltage accuracy, and low supply current. Internally, it consists of a voltage reference unit, an error amplifier, a resistor-net for output voltage setting, a current limit circuit, a thermal shutdown circuit, and a reverse current protection circuit. The RP115x uses a CMOS process for achieving low supply current, low On Resistance for low dropout voltage (Typ. 0.195 V (DFN1216-8, IOUT = 1.0 A, VSET = 1.2 V)) and CE function for long battery life. Excellent ripple rejection, input transient response, and load transient response make the RP115x ideal for the power sources of mobile communication equipment. The RP115x is available in the DFN1216-8 package for space saving and the SOT-89-5 (Output Current: 1.0 A fixed) package for higher power applications. The RP115L (DFN1216-8) can choose the output current limit between 1.0 A or 500 mA by alternating the LCON pin between “H” or “L”. The RP115H (SOT-89-5) can output only 1.0 A since it does not include the LCON pin.; VOLTAGE: 3.3V
L1-L5 = msrm:BLM?EG*1D: Murata's SMD Ferrite Bead BLM18EG Series Source: Part Numbering <https://www.murata.com/en-us/products/productdata/8796733767710/S0580E.pdf>; DC_RES: 280mOhm; DIGIKEY: 490-17345-1-ND; IMPEDANCE-FREQUENCY: 220 Ohms @ 100MHz
R1 R16 R17 = msrm:RT?FRE07*L: SMD RESISTOR; DIGIKEY: 311-0.0LRCT-ND; NOTES: Actual Part Number: RC0402FR-070RL; RVALUE: 0R; SPICEPREFIX: R
R2 = msrm:RT?FRE07*L: SMD RESISTOR; DIGIKEY: RT0402FRE0712K1L-ND; RVALUE: 12k1; SPICEPREFIX: R
R4 R5 = msrm:RT?FRE07*L: SMD RESISTOR; DIGIKEY: YAG3347CT-ND; RVALUE: 4k7; SPICEPREFIX: R
R6 R24 R25 = msrm:RT?FRE07*L: SMD RESISTOR; DIGIKEY: YAG1233CT-ND; RVALUE: 10k; SPICEPREFIX: R
R7 R26 R27 = msrm:RL?FR-7W*L: SMD RESISTOR ± 1% Tol, Paper/PE taping reel, 50 ppm/°C, 7 inch dia. Reel Source: Datasheet <http://www.yageo.com/documents/recent/PYu-RT_1-to-0.01_RoHS_L_11.pdf>; RVALUE: 10k; SPICEPREFIX: R
R8-R15 = msrm:RT?FRE07*L: SMD RESISTOR; DIGIKEY: YAG3346CT-ND; RVALUE: 49R9; SPICEPREFIX: R
R18-R23 = msrm:RT?FRE07*L: SMD RESISTOR; DIGIKEY: YAG3342CT-ND; RVALUE: 100; SPICEPREFIX: R
T1 T2 = msrm:749020100: 350µH LAN 10/100 Base-T, Power over Ethernet (PoE) Pulse Transformer 1:1 Surface Mount; DIGIKEY: 732-3268-1-ND
U1 = msrm:LAN9252: 2/3-Port EtherCAT® Slave Controller with Integrated Ethernet PHYs; DIGIKEY: LAN9252/ML-ND; TAPE_AND_REEL: Tray; TEMP: 0°C to 70°C
X1 = msrm:8743?-04*3: Wire-to-Board 1.50mm (.059") Pitch Header - SMT, Shrouded Source: http://www.molex.com/product/micro/87437.html; DIGIKEY: WM7648CT-ND; MF: MOLEX
X3 = msrm:8743?-05*3: Wire-to-Board 1.50mm (.059") Pitch Header -SMT, Shrouded Source: http://www.molex.com/product/micro/87438.html; COLOR: beige; DIGIKEY: WM7649CT-ND
Y1 = msrm:ECS-*?-TR: SMD CRYSTAL Various frequencies, with GND pins Part Numbering <http://www.ecsxtal.com/store/pdf/partnumber4.pdf>; DIGIKEY: XC3051CT-ND; F: 25MHz; F_TOLERANCE: ±10ppm; L_CAPACITANCE: 18pF

## Net classes
0 default: width 0.152 mm, drill 0.2 mm, clearance 0.076 mm
1 power: width 0.229 mm, drill 0.2 mm, clearance 0.152 mm